# Altium project PCB_Project.PrjPcb (part 1 of 2)
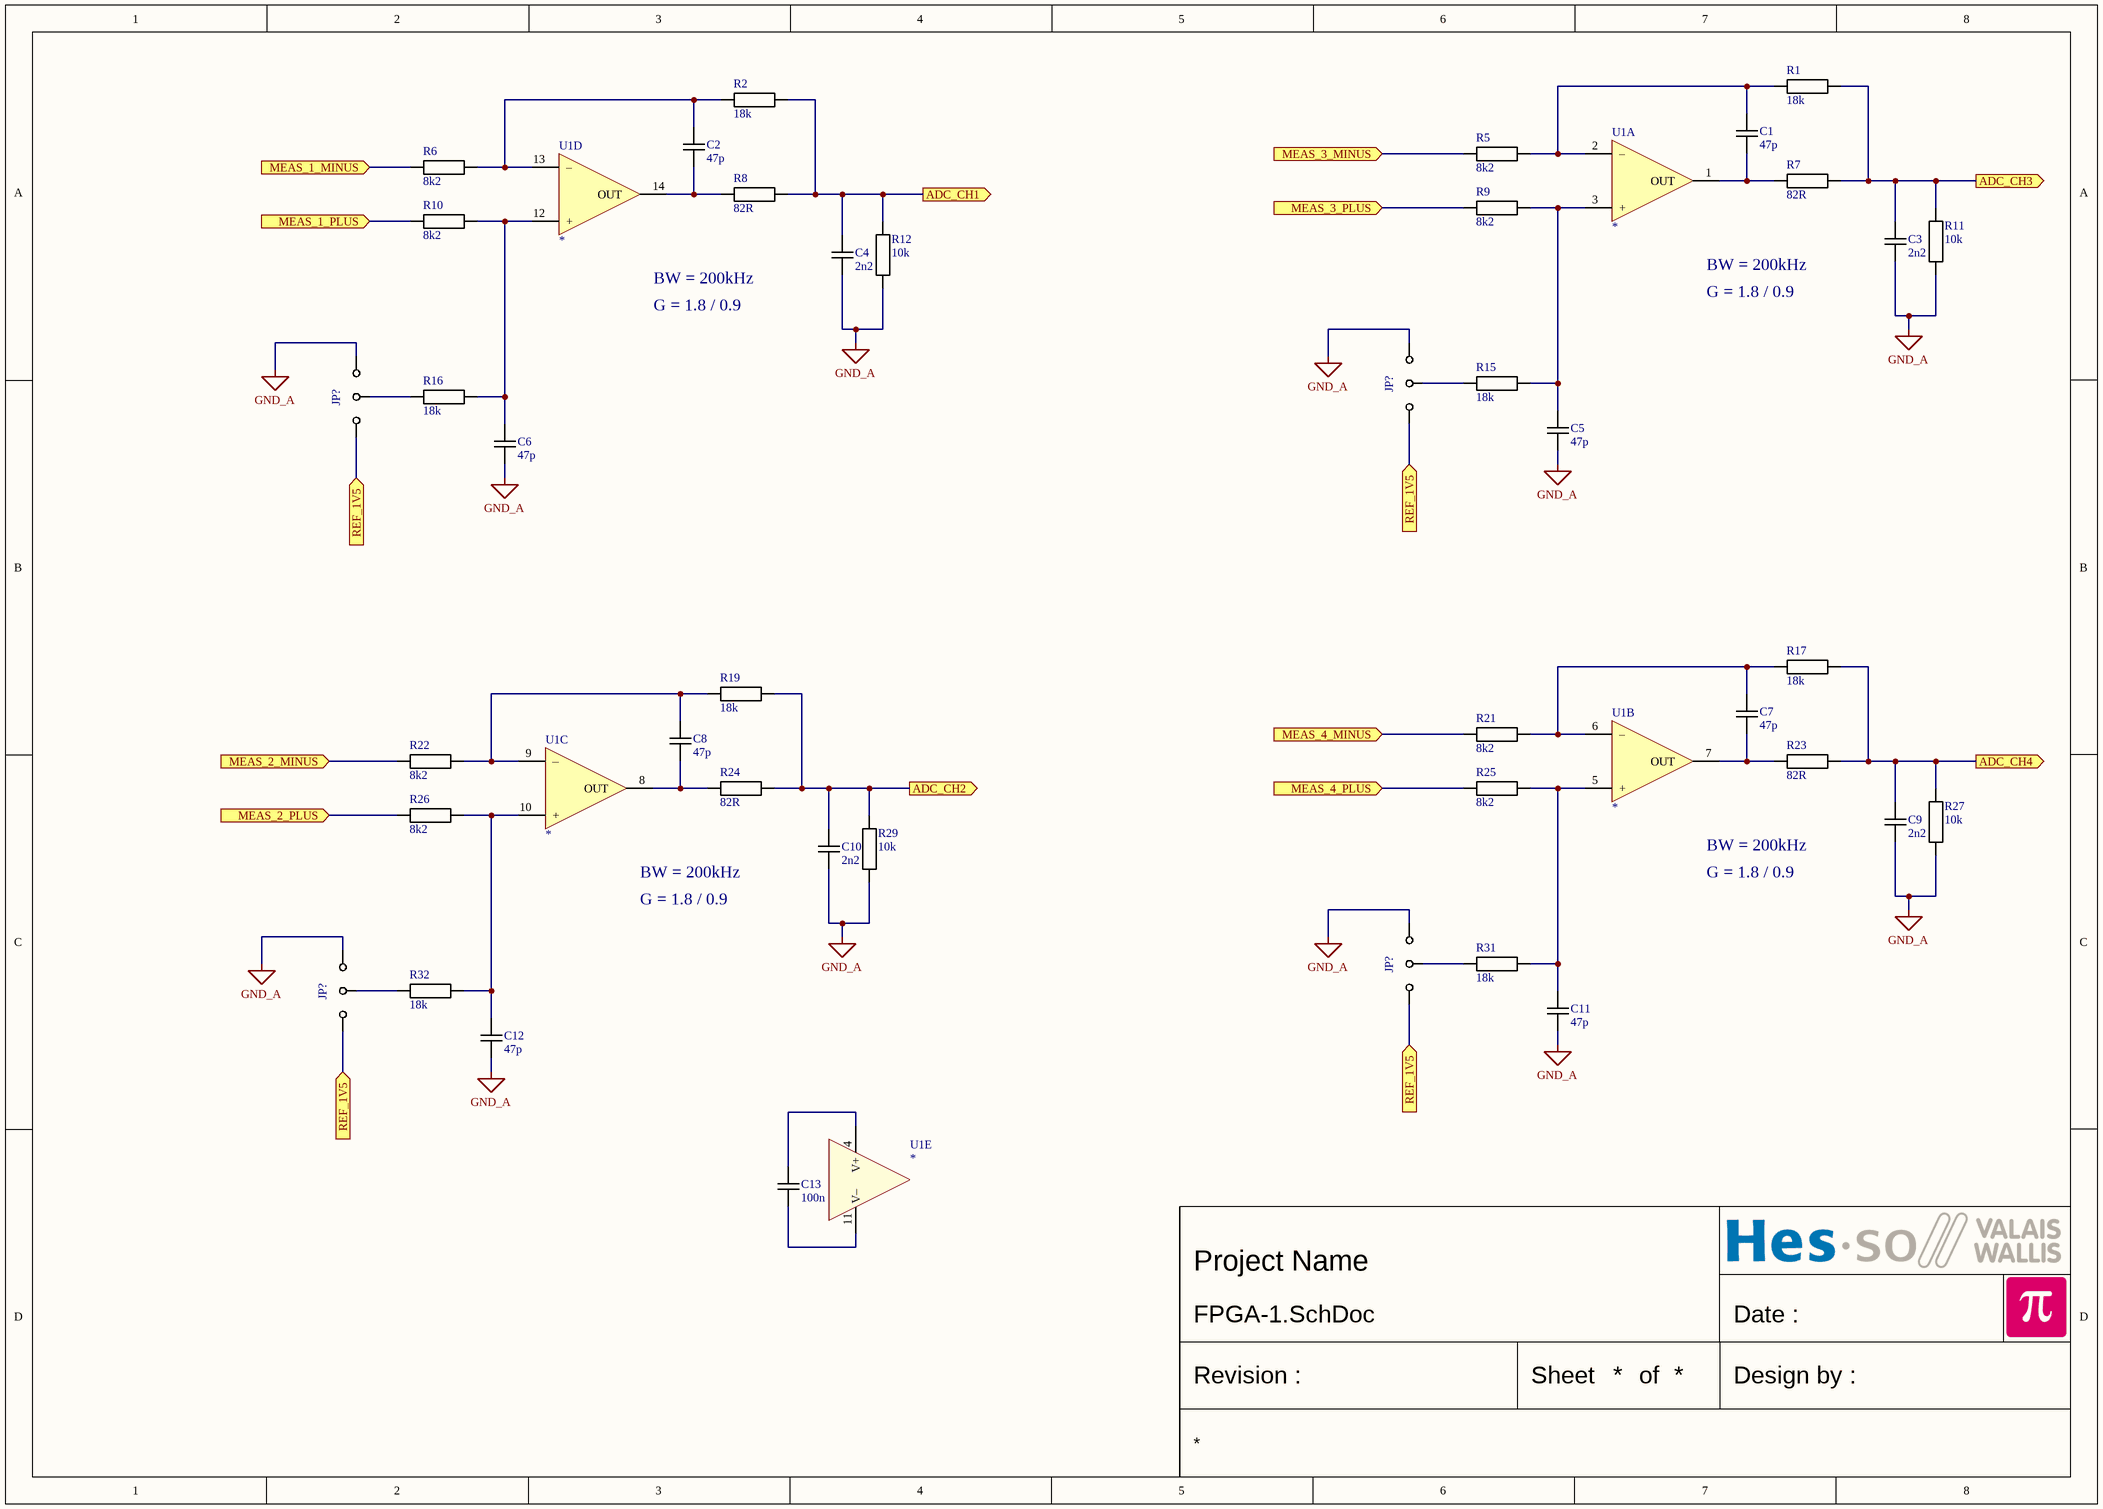
[diagram p0: FPGA-1.SchDoc]
11 sheets, 366 parts. Net scope: flat (ports and power ports of the same name join across sheets).
Board file: PCB-FPGA.PcbDoc
Sheets:
  FPGA-1.SchDoc
  FPGA.SchDoc
  FPGA-8.SchDoc
  FPGA-2.SchDoc
  FPGA-3.SchDoc
  FPGA-4.SchDoc
  FPGA-5.SchDoc
  FPGA-6.SchDoc
  FPGA-7.SchDoc
  FPGA-Connector.SchDoc
  FPGA-Supply.SchDoc

## Sheet FPGA-1.SchDoc
size A3; Date: Date; CompanyName: HESSO; Engineer: Name; Address1: Route du Rawyl 47; Address2: 1950 Sion; Address3: Switzerland; ProjectName: Project Name

### Parts
(Parts that share a designator on the sheet are numbered #1, #2 ... from top to bottom, then left to right.)
C1  47p  [CAPACITOR 1608 REFLOW]
C2  47p  [CAPACITOR 1608 REFLOW]
C3  2n2  [CAPACITOR 1608 REFLOW]
C4  2n2  [CAPACITOR 1608 REFLOW]
C5  47p  [CAPACITOR 1608 REFLOW]
C6  47p  [CAPACITOR 1608 REFLOW]
C7  47p  [CAPACITOR 1608 REFLOW]
C8  47p  [CAPACITOR 1608 REFLOW]
C9  2n2  [CAPACITOR 1608 REFLOW]
C10  2n2  [CAPACITOR 1608 REFLOW]
C11  47p  [CAPACITOR 1608 REFLOW]
C12  47p  [CAPACITOR 1608 REFLOW]
C13  100n  [CAPACITOR 1608 REFLOW]
JP?#1  {Value}  [JUMPER3 SMD 1608]  (value not drawn)
JP?#2  {Value}  [JUMPER3 SMD 1608]  (value not drawn)
JP?#3  {Value}  [JUMPER3 SMD 1608]  (value not drawn)
JP?#4  {Value}  [JUMPER3 SMD 1608]  (value not drawn)
R1  18k  [RESISTOR 1608 REFLOW]
R2  18k  [RESISTOR 1608 REFLOW]
R5  8k2  [RESISTOR 1608 REFLOW]
R6  8k2  [RESISTOR 1608 REFLOW]
R7  82R  [RESISTOR 1608 REFLOW]
R8  82R  [RESISTOR 1608 REFLOW]
R9  8k2  [RESISTOR 1608 REFLOW]
R10  8k2  [RESISTOR 1608 REFLOW]
R11  10k  [RESISTOR 1608 REFLOW]
R12  10k  [RESISTOR 1608 REFLOW]
R15  18k  [RESISTOR 1608 REFLOW]
R16  18k  [RESISTOR 1608 REFLOW]
R17  18k  [RESISTOR 1608 REFLOW]
R19  18k  [RESISTOR 1608 REFLOW]
R21  8k2  [RESISTOR 1608 REFLOW]
R22  8k2  [RESISTOR 1608 REFLOW]
R23  82R  [RESISTOR 1608 REFLOW]
R24  82R  [RESISTOR 1608 REFLOW]
R25  8k2  [RESISTOR 1608 REFLOW]
R26  8k2  [RESISTOR 1608 REFLOW]
R27  10k  [RESISTOR 1608 REFLOW]
R29  10k  [RESISTOR 1608 REFLOW]
R31  18k  [RESISTOR 1608 REFLOW]
R32  18k  [RESISTOR 1608 REFLOW]
U1  *  [SO14 P1.27 C4.0X8.8 H1.75]  (parts A,B,C,D,E of 5)

### Ports
ADC_CH1 (out), ADC_CH2 (out), ADC_CH3 (out), ADC_CH4 (out), MEAS_1_MINUS (in), MEAS_1_PLUS (in), MEAS_2_MINUS (in), MEAS_2_PLUS (in), MEAS_3_MINUS (in), MEAS_3_PLUS (in), MEAS_4_MINUS (in), MEAS_4_PLUS (in), REF_1V5 (in)

### Nets
GND_A: C3.1 C4.1 C5.1 C6.1 C9.1 C10.1 C11.1 C12.1 JP?#1.3 JP?#2.3 JP?#3.3 JP?#4.3 R11.2 R12.2 R27.2 R29.2
NetC1_1: C1.1 R7.1 U1.1(OUT)
NetC1_2: C1.2 R1.1 R5.2 U1.2(–)
NetC2_1: C2.1 R8.1 U1.14(OUT)
NetC2_2: C2.2 R2.1 R6.2 U1.13(–)
NetC3_2: C3.2 R1.2 R7.2 R11.1 ; port ADC_CH3
NetC4_2: C4.2 R2.2 R8.2 R12.1 ; port ADC_CH1
NetC5_2: C5.2 R9.2 R15.1 U1.3(+)
NetC6_2: C6.2 R10.2 R16.1 U1.12(+)
NetC7_1: C7.1 R23.1 U1.7(OUT)
NetC7_2: C7.2 R17.1 R21.2 U1.6(–)
NetC8_1: C8.1 R24.1 U1.8(OUT)
NetC8_2: C8.2 R19.1 R22.2 U1.9(–)
NetC9_2: C9.2 R17.2 R23.2 R27.1 ; port ADC_CH4
NetC10_2: C10.2 R19.2 R24.2 R29.1 ; port ADC_CH2
NetC11_2: C11.2 R25.2 R31.1 U1.5(+)
NetC12_2: C12.2 R26.2 R32.1 U1.10(+)
NetC13_1: C13.1 U1.11(V–)
NetC13_2: C13.2 U1.4(V+)
NetC106_2: JP?#1.1 JP?#2.1 JP?#3.1 JP?#4.1 ; port REF_1V5
NetJ9_3: R6.1 ; port MEAS_1_MINUS
NetJ9_4: R10.1 ; port MEAS_1_PLUS
NetJ9_5: R22.1 ; port MEAS_2_MINUS
NetJ9_6: R26.1 ; port MEAS_2_PLUS
NetJ9_7: R5.1 ; port MEAS_3_MINUS
NetJ9_8: R9.1 ; port MEAS_3_PLUS
NetJ9_9: R21.1 ; port MEAS_4_MINUS
NetJ9_10: R25.1 ; port MEAS_4_PLUS
NetJP?#1_2: JP?#1.2 R15.2
NetJP?#2_2: JP?#2.2 R16.2
NetJP?#3_2: JP?#3.2 R31.2
NetJP?#4_2: JP?#4.2 R32.2

### Notes on the sheet
- BW = 200kHz
- G = 1.8 / 0.9
- Date :
- Revision :
- Sheet
- of
- Design by :

### Library data of the parts
C1-C13 = Capacitor: Capacitor X7R 10% 50V 1608(0603)
  C1 C2 C5-C8 C11 C12: Value: 47p
  C3 C4 C9 C10: Value: 2n2
  C13: Value: 100n
JP?#1-JP?#4 = JUMPER 3 POS: Value: {Value}
R1 R2 R5-R12 R15-R17 R19 R21-R27 R29 R31 R32 = Resistor: Resistor 1% 50V 100mW 1608(0603)
  R1 R2 R15-R17 R19 R31 R32: Value: 18k
  R5 R6 R9 R10 R21 R22 R25 R26: Value: 8k2
  R7 R8 R23 R24: Value: 82R
  R11 R12 R27 R29: Value: 10k
U1 = OPA QUAD: Generic quad OPA 14 pins; Value: *

## Sheet FPGA.SchDoc
size A2; Date: Date; CompanyName: HESSO; Engineer: Name; Address1: Route du Rawyl 47; Address2: 1950 Sion; Address3: Switzerland; ProjectName: Project Name
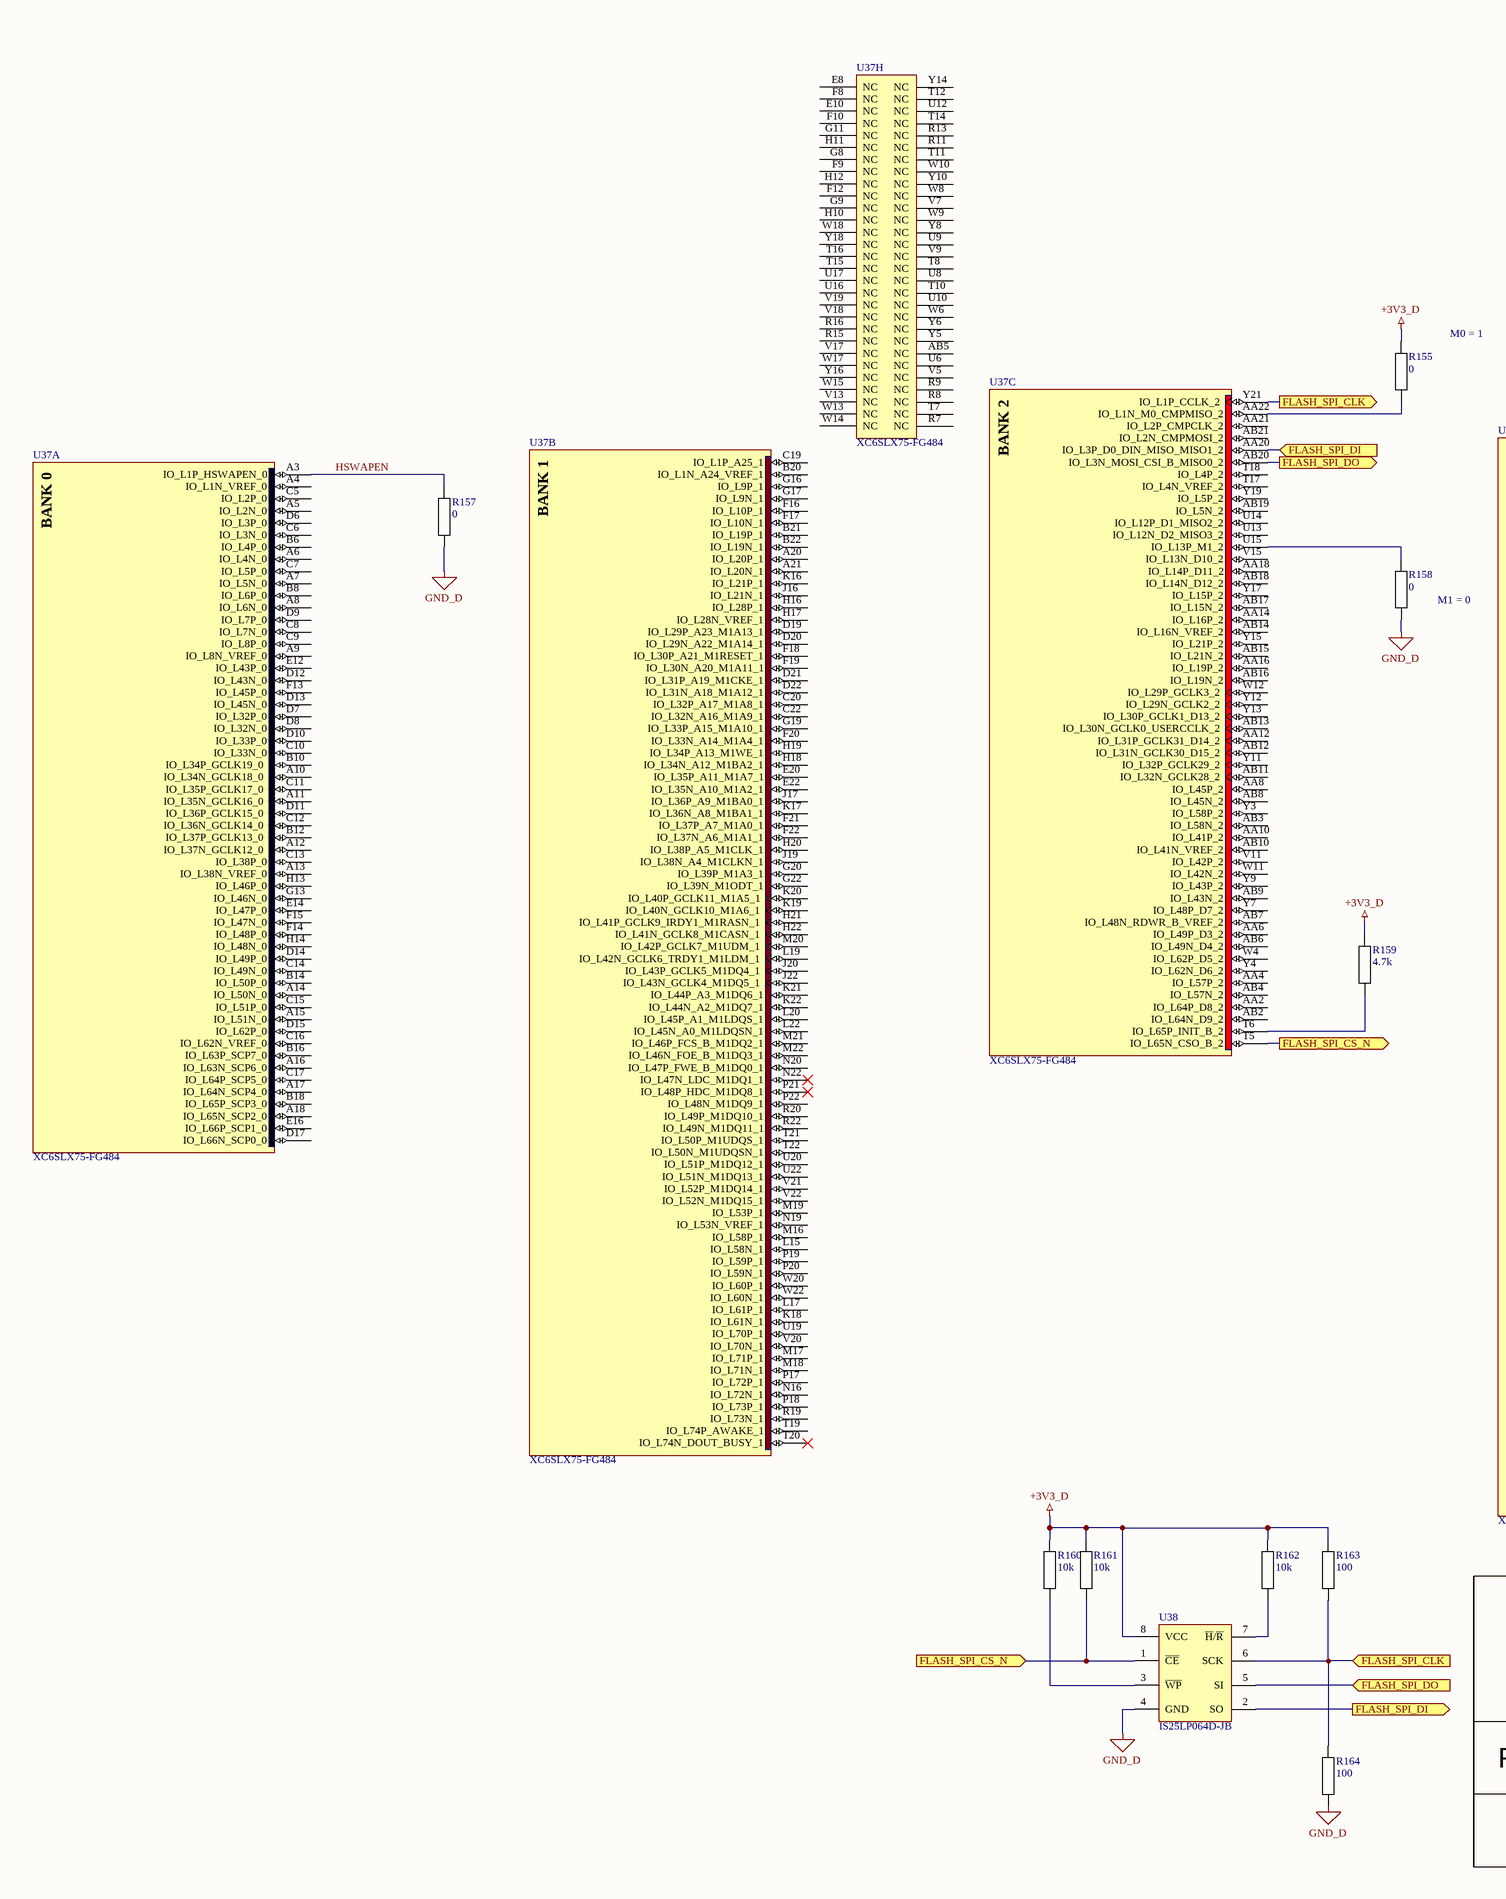
[diagram p1: FPGA.SchDoc, left]
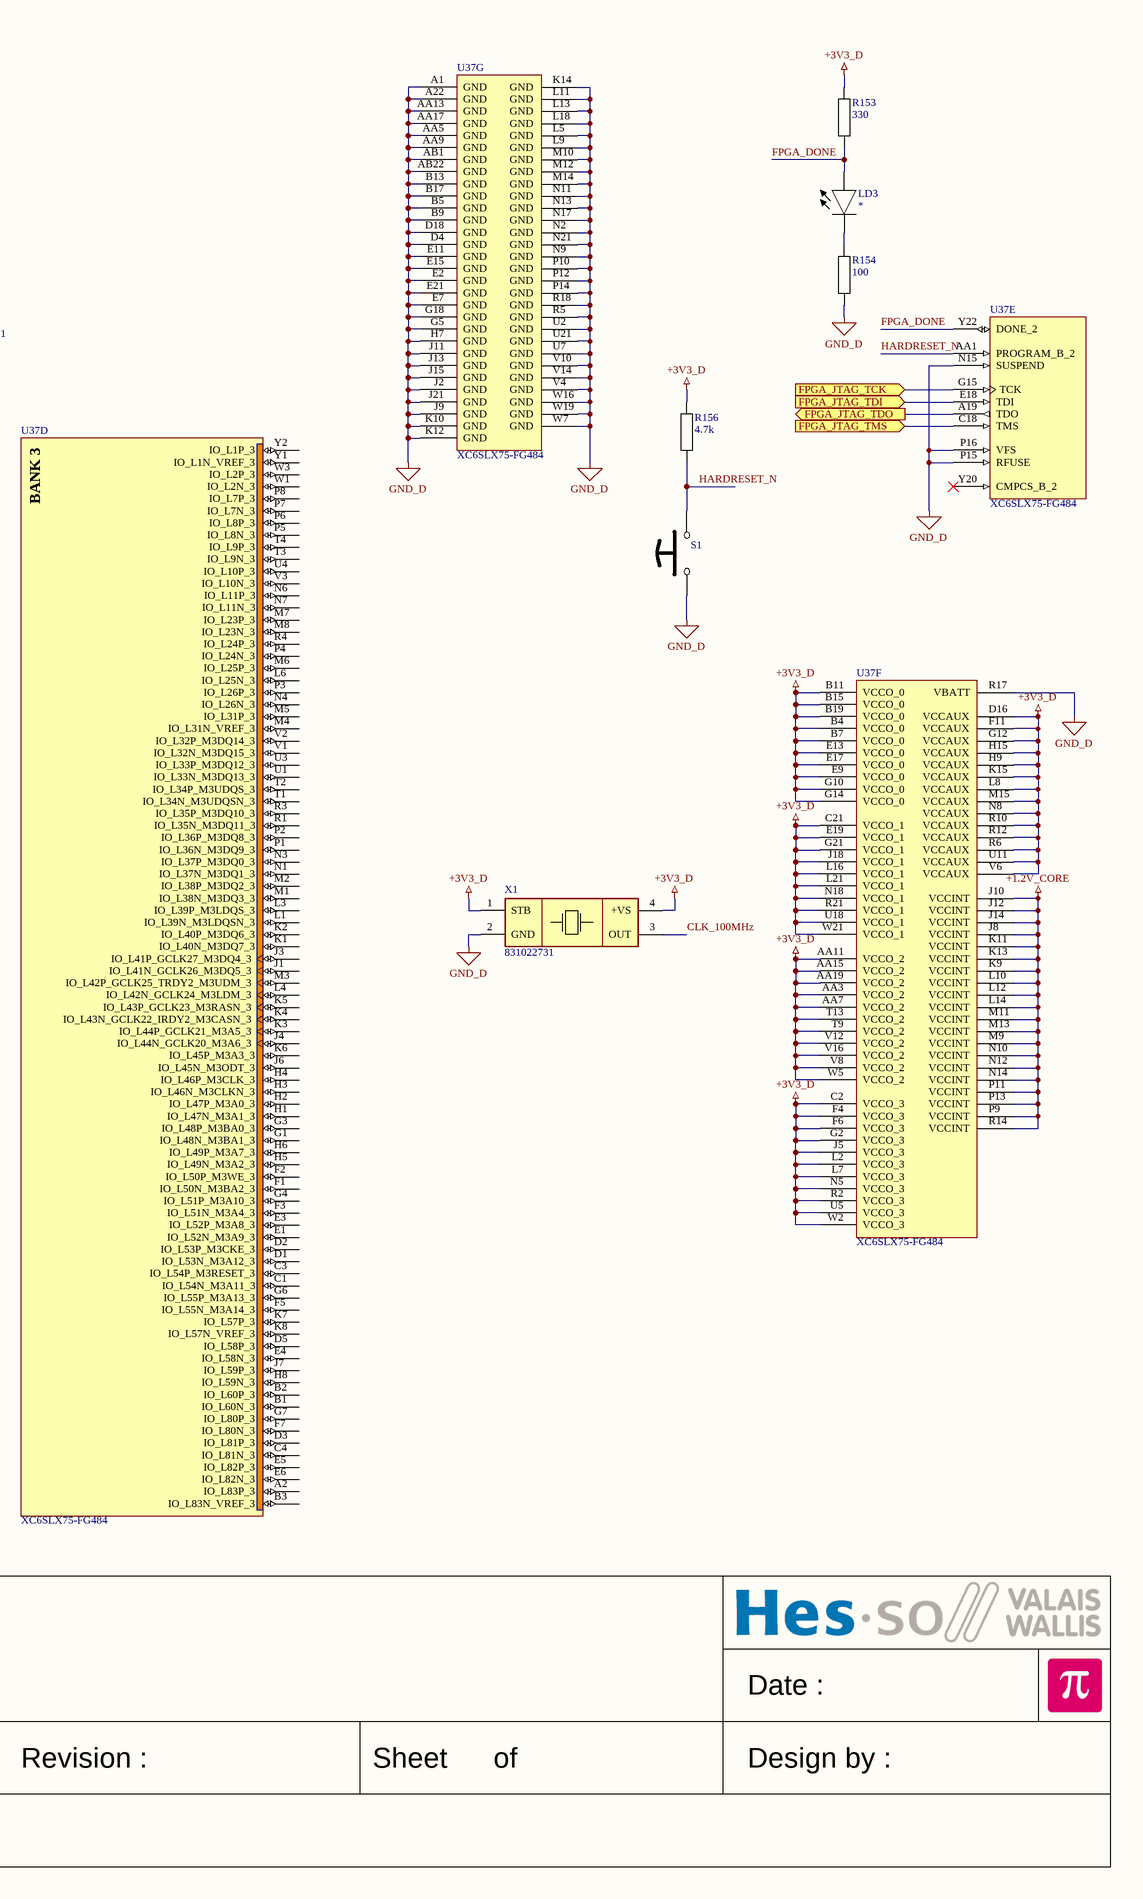
[diagram p2: FPGA.SchDoc, right]

### Parts
LD3  *  [LED 1608 REFLOW]
R153  330  [RESISTOR 2012 REFLOW]
R154  100  [RESISTOR 2012 REFLOW]
R155  0  [RESISTOR 2012 REFLOW]
R156  4.7k  [RESISTOR 2012 REFLOW]
R157  0  [RESISTOR 2012 REFLOW]
R158  0  [RESISTOR 2012 REFLOW]
R159  4.7k  [RESISTOR 2012 REFLOW]
R160  10k  [RESISTOR 1608 REFLOW]
R161  10k  [RESISTOR 1608 REFLOW]
R162  10k  [RESISTOR 1608 REFLOW]
R163  100  [RESISTOR 1608 REFLOW]
R164  100  [RESISTOR 1608 REFLOW]
S1  *  [Push Button C2.5X3.0 OMRON B3U-1000P(M)-B]  (value not drawn)
U37  XC6SLX75-FG484  [BGA484 P1.0 C23X23 H2.2]  (parts A,B,C,D,E,F,G,H of 8)
U38  IS25LP064D-JB  [SO8 P1.27 C4.0X5.0 H1.75]
X1  831022731  [Oscillator C5.2x7.2 IQD LFSPXO]

### Ports
FLASH_SPI_CLK (in), FLASH_SPI_CLK (out), FLASH_SPI_CS_N (in), FLASH_SPI_CS_N (out), FLASH_SPI_DI (in), FLASH_SPI_DI (out), FLASH_SPI_DO (in), FLASH_SPI_DO (out), FPGA_JTAG_TCK (in), FPGA_JTAG_TDI (in), FPGA_JTAG_TDO (out), FPGA_JTAG_TMS (in)

### Nets
+1.2V_CORE: U37.J8(VCCINT) U37.J10(VCCINT) U37.J12(VCCINT) U37.J14(VCCINT) U37.K9(VCCINT) U37.K11(VCCINT) U37.K13(VCCINT) U37.L10(VCCINT) U37.L12(VCCINT) U37.L14(VCCINT) U37.M9(VCCINT) U37.M11(VCCINT) U37.M13(VCCINT) U37.N10(VCCINT) U37.N12(VCCINT) U37.N14(VCCINT) U37.P9(VCCINT) U37.P11(VCCINT) U37.P13(VCCINT) U37.R14(VCCINT)
+3V3_D: R153.2 R155.2 R156.2 R159.2 R160.2 R161.2 R162.2 R163.2 U37.AA3(VCCO_2) U37.AA7(VCCO_2) U37.AA11(VCCO_2) U37.AA15(VCCO_2) U37.AA19(VCCO_2) U37.B4(VCCO_0) U37.B7(VCCO_0) U37.B11(VCCO_0) U37.B15(VCCO_0) U37.B19(VCCO_0) U37.C2(VCCO_3) U37.C21(VCCO_1) U37.D16(VCCAUX) U37.E9(VCCO_0) U37.E13(VCCO_0) U37.E17(VCCO_0) U37.E19(VCCO_1) U37.F4(VCCO_3) U37.F6(VCCO_3) U37.F11(VCCAUX) U37.G2(VCCO_3) U37.G10(VCCO_0) U37.G12(VCCAUX) U37.G14(VCCO_0) U37.G21(VCCO_1) U37.H9(VCCAUX) U37.H15(VCCAUX) U37.J5(VCCO_3) U37.J18(VCCO_1) U37.K15(VCCAUX) U37.L2(VCCO_3) U37.L7(VCCO_3) U37.L8(VCCAUX) U37.L16(VCCO_1) U37.L21(VCCO_1) U37.M15(VCCAUX) U37.N5(VCCO_3) U37.N8(VCCAUX) U37.N18(VCCO_1) U37.R2(VCCO_3) U37.R6(VCCAUX) U37.R10(VCCAUX) U37.R12(VCCAUX) U37.R21(VCCO_1) U37.T9(VCCO_2) U37.T13(VCCO_2) U37.U5(VCCO_3) U37.U11(VCCAUX) U37.U18(VCCO_1) U37.V6(VCCAUX) U37.V8(VCCO_2) U37.V12(VCCO_2) U37.V16(VCCO_2) U37.W2(VCCO_3) U37.W5(VCCO_2) U37.W21(VCCO_1) U38.8(VCC) X1.1(STB) X1.4(+VS)
GND_D: R154.1 R157.1 R158.1 R164.1 S1.1 U37.A1(GND) U37.A22(GND) U37.AA5(GND) U37.AA9(GND) U37.AA13(GND) U37.AA17(GND) U37.AB1(GND) U37.AB22(GND) U37.B5(GND) U37.B9(GND) U37.B13(GND) U37.B17(GND) U37.D4(GND) U37.D18(GND) U37.E2(GND) U37.E7(GND) U37.E11(GND) U37.E15(GND) U37.E21(GND) U37.G5(GND) U37.G18(GND) U37.H7(GND) U37.J2(GND) U37.J9(GND) U37.J11(GND) U37.J13(GND) U37.J15(GND) U37.J21(GND) U37.K10(GND) U37.K12(GND) U37.K14(GND) U37.L5(GND) U37.L9(GND) U37.L11(GND) U37.L13(GND) U37.L18(GND) U37.M10(GND) U37.M12(GND) U37.M14(GND) U37.N2(GND) U37.N9(GND) U37.N11(GND) U37.N13(GND) U37.N15(SUSPEND) U37.N17(GND) U37.N21(GND) U37.P10(GND) U37.P12(GND) U37.P14(GND) U37.P15(RFUSE) U37.P16(VFS) U37.R5(GND) U37.R17(VBATT) U37.R18(GND) U37.U2(GND) U37.U7(GND) U37.U21(GND) U37.V4(GND) U37.V10(GND) U37.V14(GND) U37.W7(GND) U37.W16(GND) U37.W19(GND) U38.4(GND) X1.2(GND)
CLK_100MHz: X1.3(OUT)
FPGA_DONE: LD3.2(A) R153.1 U37.Y22(DONE_2)
HARDRESET_N: R156.1 S1.2 U37.AA1(PROGRAM_B_2)
HSWAPEN: R157.2 U37.A3(IO_L1P_HSWAPEN_0)
NetJ12_3: U37.C18(TMS) ; port FPGA_JTAG_TMS
NetJ12_5: U37.G15(TCK) ; port FPGA_JTAG_TCK
NetJ12_7: U37.A19(TDO) ; port FPGA_JTAG_TDO
NetJ12_9: U37.E18(TDI) ; port FPGA_JTAG_TDI
NetLD3_1: LD3.1(C) R154.2
NetR155_1: R155.1 U37.AA22(IO_L1N_M0_CMPMISO_2)
NetR158_2: R158.2 U37.U15(IO_L13P_M1_2)
NetR159_1: R159.1 U37.T6(IO_L65P_INIT_B_2)
NetR160_1: R160.1 U38.3(~{WP})
NetR161_1: R161.1 U37.T5(IO_L65N_CSO_B_2) U38.1(~{CE}) ; port FLASH_SPI_CS_N
NetR162_1: R162.1 U38.7(~{H}/~{R})
NetR163_1: R163.1 R164.2 U37.Y21(IO_L1P_CCLK_2) U38.6(SCK) ; port FLASH_SPI_CLK
NetU37_AA20: U37.AA20(IO_L3P_D0_DIN_MISO_MISO1_2) U38.2(SO) ; port FLASH_SPI_DI
NetU37_AB20: U37.AB20(IO_L3N_MOSI_CSI_B_MISO0_2) U38.5(SI) ; port FLASH_SPI_DO

Not connected (* = marked no-connect by the designer): U37 A2(IO_L83P_3) A4(IO_L1N_VREF_0) A5(IO_L2N_0) A6(IO_L4N_0) A7(IO_L5N_0) A8(IO_L6N_0) A9(IO_L8N_VREF_0) A10(IO_L34N_GCLK18_0) A11(IO_L35N_GCLK16_0) A12(IO_L37N_GCLK12_0) A13(IO_L38N_VREF_0) A14(IO_L50N_0) A15(IO_L51N_0) A16(IO_L63N_SCP6_0) A17(IO_L64N_SCP4_0) A18(IO_L65N_SCP2_0) A20(IO_L20P_1) A21(IO_L20N_1) AA2(IO_L64P_D8_2) AA4(IO_L57P_2) AA6(IO_L49P_D3_2) AA8(IO_L45P_2) AA10(IO_L41P_2) AA12(IO_L31P_GCLK31_D14_2) AA14(IO_L16P_2) AA16(IO_L19P_2) AA18(IO_L14P_D11_2) AA21(IO_L2P_CMPCLK_2) AB2(IO_L64N_D9_2) AB3(IO_L58N_2) AB4(IO_L57N_2) AB5(NC) AB6(IO_L49N_D4_2) AB7(IO_L48N_RDWR_B_VREF_2) AB8(IO_L45N_2) AB9(IO_L43N_2) AB10(IO_L41N_VREF_2) AB11(IO_L32N_GCLK28_2) AB12(IO_L31N_GCLK30_D15_2) AB13(IO_L30N_GCLK0_USERCCLK_2) AB14(IO_L16N_VREF_2) AB15(IO_L21N_2) AB16(IO_L19N_2) AB17(IO_L15N_2) AB18(IO_L14N_D12_2) AB19(IO_L5N_2) AB21(IO_L2N_CMPMOSI_2) B1(IO_L60N_3) B2(IO_L60P_3) B3(IO_L83N_VREF_3) B6(IO_L4P_0) B8(IO_L6P_0) B10(IO_L34P_GCLK19_0) B12(IO_L37P_GCLK13_0) B14(IO_L50P_0) B16(IO_L63P_SCP7_0) B18(IO_L65P_SCP3_0) B20(IO_L1N_A24_VREF_1) B21(IO_L19P_1) B22(IO_L19N_1) C1(IO_L54N_M3A11_3) C3(IO_L54P_M3RESET_3) C4(IO_L81N_3) C5(IO_L2P_0) C6(IO_L3N_0) C7(IO_L5P_0) C8(IO_L7N_0) C9(IO_L8P_0) C10(IO_L33N_0) C11(IO_L35P_GCLK17_0) C12(IO_L36N_GCLK14_0) C13(IO_L38P_0) C14(IO_L49N_0) C15(IO_L51P_0) C16(IO_L62N_VREF_0) C17(IO_L64P_SCP5_0) C19(IO_L1P_A25_1) C20(IO_L32P_A17_M1A8_1) C22(IO_L32N_A16_M1A9_1) D1(IO_L53N_M3A12_3) D2(IO_L53P_M3CKE_3) D3(IO_L81P_3) D5(IO_L58P_3) D6(IO_L3P_0) D7(IO_L32P_0) D8(IO_L32N_0) D9(IO_L7P_0) D10(IO_L33P_0) D11(IO_L36P_GCLK15_0) D12(IO_L43N_0) D13(IO_L45N_0) D14(IO_L49P_0) D15(IO_L62P_0) D17(IO_L66N_SCP0_0) D19(IO_L29P_A23_M1A13_1) D20(IO_L29N_A22_M1A14_1) D21(IO_L31P_A19_M1CKE_1) D22(IO_L31N_A18_M1A12_1) E1(IO_L52N_M3A9_3) E3(IO_L52P_M3A8_3) E4(IO_L58N_3) E5(IO_L82P_3) E6(IO_L82N_3) E8(NC) E10(NC) E12(IO_L43P_0) E14(IO_L47P_0) E16(IO_L66P_SCP1_0) E20(IO_L35P_A11_M1A7_1) E22(IO_L35N_A10_M1A2_1) F1(IO_L50N_M3BA2_3) F2(IO_L50P_M3WE_3) F3(IO_L51N_M3A4_3) F5(IO_L55N_M3A14_3) F7(IO_L80N_3) F8(NC) F9(NC) F10(NC) F12(NC) F13(IO_L45P_0) F14(IO_L48P_0) F15(IO_L47N_0) F16(IO_L10P_1) F17(IO_L10N_1) F18(IO_L30P_A21_M1RESET_1) F19(IO_L30N_A20_M1A11_1) F20(IO_L33N_A14_M1A4_1) F21(IO_L37P_A7_M1A0_1) F22(IO_L37N_A6_M1A1_1) G1(IO_L48N_M3BA1_3) G3(IO_L48P_M3BA0_3) G4(IO_L51P_M3A10_3) G6(IO_L55P_M3A13_3) G7(IO_L80P_3) G8(NC) G9(NC) G11(NC) G13(IO_L46N_0) G16(IO_L9P_1) G17(IO_L9N_1) G19(IO_L33P_A15_M1A10_1) G20(IO_L39P_M1A3_1) G22(IO_L39N_M1ODT_1) H1(IO_L47N_M3A1_3) H2(IO_L47P_M3A0_3) H3(IO_L46N_M3CLKN_3) H4(IO_L46P_M3CLK_3) H5(IO_L49N_M3A2_3) H6(IO_L49P_M3A7_3) H8(IO_L59N_3) H10(NC) H11(NC) H12(NC) H13(IO_L46P_0) H14(IO_L48N_0) H16(IO_L28P_1) H17(IO_L28N_VREF_1) H18(IO_L34N_A12_M1BA2_1) H19(IO_L34P_A13_M1WE_1) H20(IO_L38P_A5_M1CLK_1) H21(IO_L41P_GCLK9_IRDY1_M1RASN_1) H22(IO_L41N_GCLK8_M1CASN_1) J1(IO_L41N_GCLK26_M3DQ5_3) J3(IO_L41P_GCLK27_M3DQ4_3) J4(IO_L44N_GCLK20_M3A6_3) J6(IO_L45N_M3ODT_3) J7(IO_L59P_3) J16(IO_L21N_1) J17(IO_L36P_A9_M1BA0_1) J19(IO_L38N_A4_M1CLKN_1) J20(IO_L43P_GCLK5_M1DQ4_1) J22(IO_L43N_GCLK4_M1DQ5_1) K1(IO_L40N_M3DQ7_3) K2(IO_L40P_M3DQ6_3) K3(IO_L44P_GCLK21_M3A5_3) K4(IO_L43N_GCLK22_IRDY2_M3CASN_3) K5(IO_L43P_GCLK23_M3RASN_3) K6(IO_L45P_M3A3_3) K7(IO_L57P_3) K8(IO_L57N_VREF_3) K16(IO_L21P_1) K17(IO_L36N_A8_M1BA1_1) K18(IO_L61N_1) K19(IO_L40N_GCLK10_M1A6_1) K20(IO_L40P_GCLK11_M1A5_1) K21(IO_L44P_A3_M1DQ6_1) K22(IO_L44N_A2_M1DQ7_1) L1(IO_L39N_M3LDQSN_3) L3(IO_L39P_M3LDQS_3) L4(IO_L42N_GCLK24_M3LDM_3) L6(IO_L25N_3) L15(IO_L58N_1) L17(IO_L61P_1) L19(IO_L42N_GCLK6_TRDY1_M1LDM_1) L20(IO_L45P_A1_M1LDQS_1) L22(IO_L45N_A0_M1LDQSN_1) M1(IO_L38N_M3DQ3_3) M2(IO_L38P_M3DQ2_3) M3(IO_L42P_GCLK25_TRDY2_M3UDM_3) M4(IO_L31N_VREF_3) M5(IO_L31P_3) M6(IO_L25P_3) M7(IO_L23P_3) M8(IO_L23N_3) M16(IO_L58P_1) M17(IO_L71P_1) M18(IO_L71N_1) M19(IO_L53P_1) M20(IO_L42P_GCLK7_M1UDM_1) M21(IO_L46P_FCS_B_M1DQ2_1) M22(IO_L46N_FOE_B_M1DQ3_1) N1(IO_L37N_M3DQ1_3) N3(IO_L37P_M3DQ0_3) N4(IO_L26N_3) N6(IO_L11P_3) N7(IO_L11N_3) N16(IO_L72N_1) N19(IO_L53N_VREF_1) N20(IO_L47P_FWE_B_M1DQ0_1) N22(IO_L47N_LDC_M1DQ1_1)* P1(IO_L36N_M3DQ9_3) P2(IO_L36P_M3DQ8_3) P3(IO_L26P_3) P4(IO_L24N_3) P5(IO_L8N_3) P6(IO_L8P_3) P7(IO_L7N_3) P8(IO_L7P_3) P17(IO_L72P_1) P18(IO_L73P_1) P19(IO_L59P_1) P20(IO_L59N_1) P21(IO_L48P_HDC_M1DQ8_1)* P22(IO_L48N_M1DQ9_1) R1(IO_L35N_M3DQ11_3) R3(IO_L35P_M3DQ10_3) R4(IO_L24P_3) R7(NC) R8(NC) R9(NC) R11(NC) R13(NC) R15(NC) R16(NC) R19(IO_L73N_1) R20(IO_L49P_M1DQ10_1) R22(IO_L49N_M1DQ11_1) T1(IO_L34N_M3UDQSN_3) T2(IO_L34P_M3UDQS_3) T3(IO_L9N_3) T4(IO_L9P_3) T7(NC) T8(NC) T10(NC) T11(NC) T12(NC) T14(NC) T15(NC) T16(NC) T17(IO_L4N_VREF_2) T18(IO_L4P_2) T19(IO_L74P_AWAKE_1) T20(IO_L74N_DOUT_BUSY_1)* T21(IO_L50P_M1UDQS_1) T22(IO_L50N_M1UDQSN_1) U1(IO_L33N_M3DQ13_3) U3(IO_L33P_M3DQ12_3) U4(IO_L10P_3) U6(NC) U8(NC) U9(NC) U10(NC) U12(NC) U13(IO_L12N_D2_MISO3_2) U14(IO_L12P_D1_MISO2_2) U16(NC) U17(NC) U19(IO_L70P_1) U20(IO_L51P_M1DQ12_1) U22(IO_L51N_M1DQ13_1) V1(IO_L32N_M3DQ15_3) V2(IO_L32P_M3DQ14_3) V3(IO_L10N_3) V5(NC) V7(NC) V9(NC) V11(IO_L42P_2) V13(NC) V15(IO_L13N_D10_2) V17(NC) V18(NC) V19(NC) V20(IO_L70N_1) V21(IO_L52P_M1DQ14_1) V22(IO_L52N_M1DQ15_1) W1(IO_L2N_3) W3(IO_L2P_3) W4(IO_L62P_D5_2) W6(NC) W8(NC) W9(NC) W10(NC) W11(IO_L42N_2) W12(IO_L29P_GCLK3_2) W13(NC) W14(NC) W15(NC) W17(NC) W18(NC) W20(IO_L60P_1) W22(IO_L60N_1) Y1(IO_L1N_VREF_3) Y2(IO_L1P_3) Y3(IO_L58P_2) Y4(IO_L62N_D6_2) Y5(NC) Y6(NC) Y7(IO_L48P_D7_2) Y8(NC) Y9(IO_L43P_2) Y10(NC) Y11(IO_L32P_GCLK29_2) Y12(IO_L29N_GCLK2_2) Y13(IO_L30P_GCLK1_D13_2) Y14(NC) Y15(IO_L21P_2) Y16(NC) Y17(IO_L15P_2) Y18(NC) Y19(IO_L5P_2) Y20(CMPCS_B_2)*

### Notes on the sheet
- M0 = 1
- (near R158) M1 = 0
- Date :
- Revision :
- Sheet
- of
- Design by :
- (in symbol XC6SLX75-FG484, part A) BANK 0
- (in symbol XC6SLX75-FG484, part B) BANK 1
- (in symbol XC6SLX75-FG484, part C) BANK 2
- (in symbol XC6SLX75-FG484, part D) BANK 3

### Library data of the parts
LD3 = LED: LED generic; Value: *
R153-R159 = Resistor: Resistor 1% 50V 125mW 2012(0805)
  R153: Value: 330
  R154: Value: 100
  R155 R157 R158: Value: 0
  R156 R159: Value: 4.7k
R160-R164 = Resistor: Resistor 1% 50V 100mW 1608(0603)
  R160-R162: Value: 10k
  R163 R164: Value: 100
S1 = Push Button 2Pins: Push Button, 2 pins; Value: *
U37 = XC6SLX75-FG484: Spartan-6 LXT 1.2V FPGA, 268 User I/Os, 484-Ball Fine-Pitch BGA (1.0mm Pitch); Value: XC6SLX75-FG484
U38 = IS25LP064D-JB: 64Mb Serial Flash Memory; Value: IS25LP064D-JB
X1 = Oscillator C5.2x7.2 IQD LFSPXO: Value: 831022731; MouserNumber: 710-831022731

## Sheet FPGA-8.SchDoc
size A3; Date: Date; CompanyName: HESSO; Engineer: Name; Address1: Route du Rawyl 47; Address2: 1950 Sion; Address3: Switzerland; ProjectName: Project Name
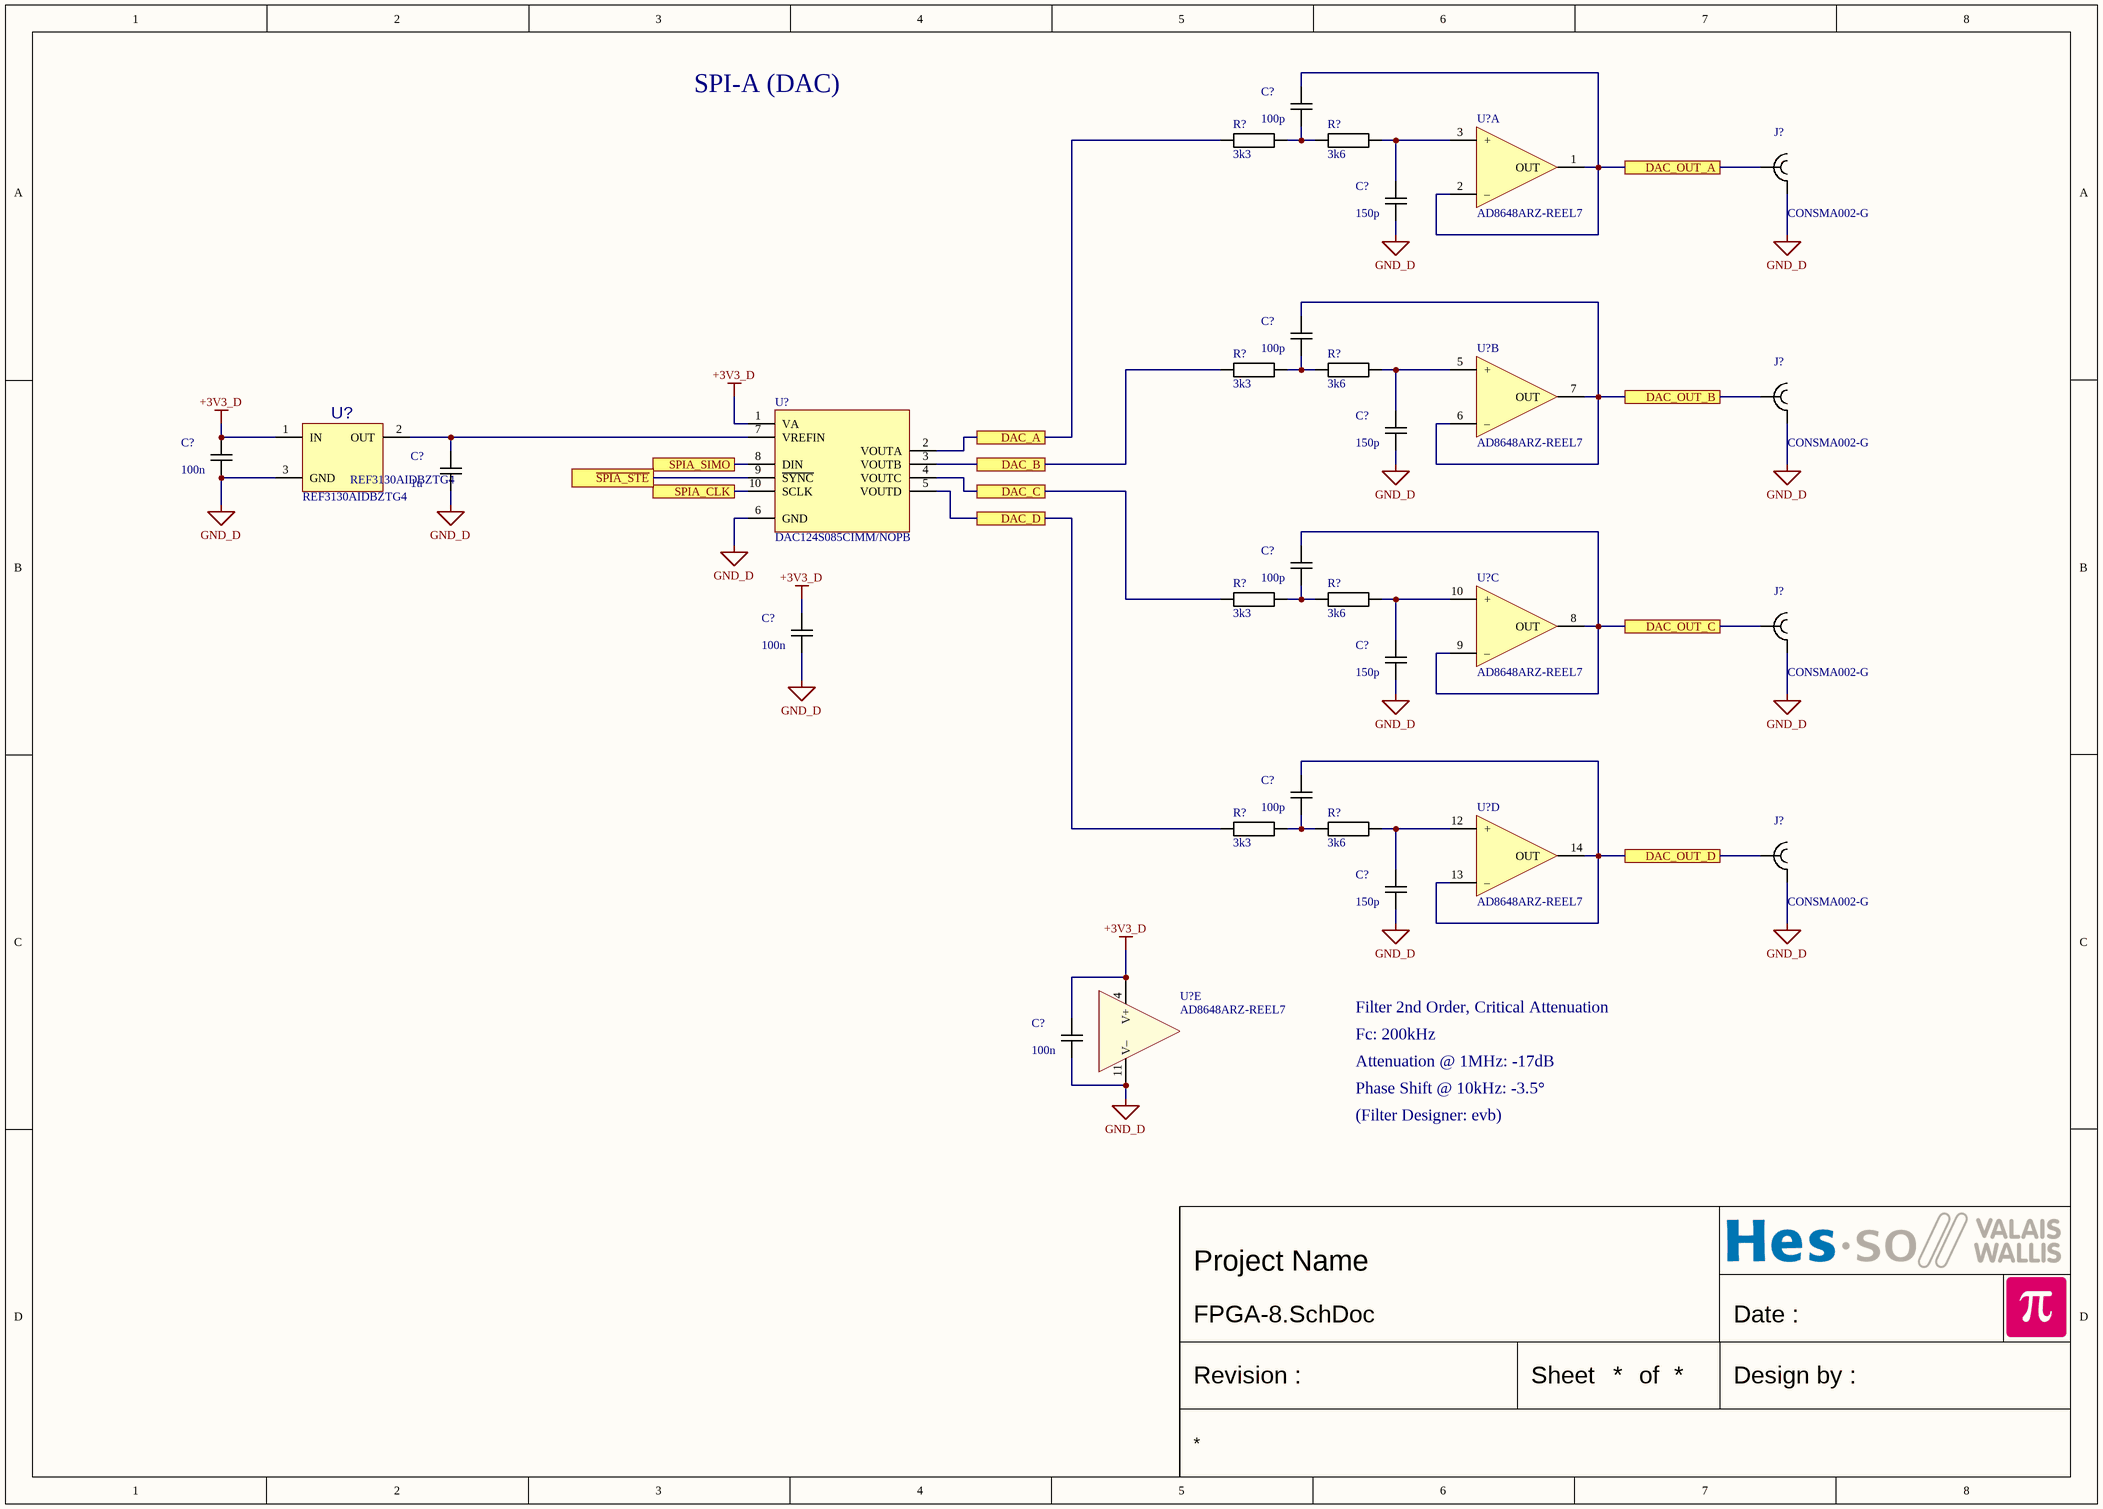
[diagram p3: FPGA-8.SchDoc]

### Parts
(Parts that share a designator on the sheet are numbered #1, #2 ... from top to bottom, then left to right.)
C?#1  100p  [CAPACITOR 2012 REFLOW]
C?#2  150p  [CAPACITOR 2012 REFLOW]
C?#3  100p  [CAPACITOR 2012 REFLOW]
C?#4  150p  [CAPACITOR 2012 REFLOW]
C?#5  100n  [CAPACITOR 2012 REFLOW]
C?#6  1u  [CAPACITOR 2012 REFLOW]
C?#7  100p  [CAPACITOR 2012 REFLOW]
C?#8  100n  [CAPACITOR 1608 REFLOW]
C?#9  150p  [CAPACITOR 2012 REFLOW]
C?#10  100p  [CAPACITOR 2012 REFLOW]
C?#11  150p  [CAPACITOR 2012 REFLOW]
C?#12  100n  [CAPACITOR 1608 REFLOW]
J?#1  CONSMA002-G  [SMA TH Right Angle Linx CONSMA002]
J?#2  CONSMA002-G  [SMA TH Right Angle Linx CONSMA002]
J?#3  CONSMA002-G  [SMA TH Right Angle Linx CONSMA002]
J?#4  CONSMA002-G  [SMA TH Right Angle Linx CONSMA002]
R?#1  3k3  [RESISTOR 2012 REFLOW]
R?#2  3k6  [RESISTOR 2012 REFLOW]
R?#3  3k3  [RESISTOR 2012 REFLOW]
R?#4  3k6  [RESISTOR 2012 REFLOW]
R?#5  3k3  [RESISTOR 2012 REFLOW]
R?#6  3k6  [RESISTOR 2012 REFLOW]
R?#7  3k3  [RESISTOR 2012 REFLOW]
R?#8  3k6  [RESISTOR 2012 REFLOW]
U?#1  AD8648ARZ-REEL7  [SO14 P1.27 C4.0X8.8 H1.75]  (part A of 5)
U?#2  DAC124S085CIMM/NOPB  [VSSOP10 P0.5 C3.1X3.1 H1.1]
U?#3  AD8648ARZ-REEL7  [SO14 P1.27 C4.0X8.8 H1.75]  (part B of 5)
U?#4  REF3130AIDBZTG4  [SOT23 P0.95 C1.6x3.0 H1.3]
U?#5  AD8648ARZ-REEL7  [SO14 P1.27 C4.0X8.8 H1.75]  (part C of 5)
U?#6  AD8648ARZ-REEL7  [SO14 P1.27 C4.0X8.8 H1.75]  (part D of 5)
U?#7  AD8648ARZ-REEL7  [SO14 P1.27 C4.0X8.8 H1.75]  (part E of 5)

### Ports
DAC_A, DAC_B, DAC_C, DAC_D, DAC_OUT_A, DAC_OUT_B, DAC_OUT_C, DAC_OUT_D, SPIA_CLK, SPIA_SIMO, ~{SPIA_STE}

### Nets
+3V3_D: C?#5.2 C?#8.2 C?#12.2 U?#2.1(VA) U?#4.1(IN) U?#7.4(V+)
GND_D: C?#2.1 C?#4.1 C?#5.1 C?#6.1 C?#8.1 C?#9.1 C?#11.1 C?#12.1 J?#1.2 J?#2.2 J?#3.2 J?#4.2 U?#2.6(GND) U?#4.3(GND) U?#7.11(V–)
NetC?#1_1: C?#1.1 R?#1.2 R?#2.1
NetC?#1_2: C?#1.2 J?#1.1 U?#1.1(OUT) U?#1.2(–) ; port DAC_OUT_A
NetC?#2_2: C?#2.2 R?#2.2 U?#1.3(+)
NetC?#3_1: C?#3.1 R?#3.2 R?#4.1
NetC?#3_2: C?#3.2 J?#2.1 U?#3.6(–) U?#3.7(OUT) ; port DAC_OUT_B
NetC?#4_2: C?#4.2 R?#4.2 U?#3.5(+)
NetC?#6_2: C?#6.2 U?#2.7(VREFIN) U?#4.2(OUT)
NetC?#7_1: C?#7.1 R?#5.2 R?#6.1
NetC?#7_2: C?#7.2 J?#3.1 U?#5.8(OUT) U?#5.9(–) ; port DAC_OUT_C
NetC?#9_2: C?#9.2 R?#6.2 U?#5.10(+)
NetC?#10_1: C?#10.1 R?#7.2 R?#8.1
NetC?#10_2: C?#10.2 J?#4.1 U?#6.13(–) U?#6.14(OUT) ; port DAC_OUT_D
NetC?#11_2: C?#11.2 R?#8.2 U?#6.12(+)
NetR?#1_1: R?#1.1 U?#2.2(VOUTA) ; port DAC_A
NetR?#3_1: R?#3.1 U?#2.3(VOUTB) ; port DAC_B
NetR?#5_1: R?#5.1 U?#2.4(VOUTC) ; port DAC_C
NetR?#7_1: R?#7.1 U?#2.5(VOUTD) ; port DAC_D
NetU?#2_8: U?#2.8(DIN) ; port SPIA_SIMO
NetU?#2_9: U?#2.9(~{SYNC}) ; port ~{SPIA_STE}
NetU?#2_10: U?#2.10(SCLK) ; port SPIA_CLK

### Notes on the sheet
- SPI-A (DAC)
- Filter 2nd Order, Critical Attenuation
- Fc: 200kHz
- Attenuation @ 1MHz: -17dB
- Phase Shift @ 10kHz: -3.5°
- (Filter Designer: evb)
- Date :
- Revision :
- Sheet
- of
- Design by :

### Library data of the parts
C?#1-C?#5 C?#7 C?#9-C?#11 = Capacitor: Capacitor X7R 10% 50V 2012(0805)
  C?#1 C?#3 C?#7 C?#10: Value: 100p
  C?#2 C?#4 C?#9 C?#11: Value: 150p
  C?#5: Value: 100n
C?#6 = Capacitor: Capacitor X7R 10% 10V 2012(0805); Value: 1u
C?#8 C?#12 = Capacitor: Capacitor X7R 10% 50V 1608(0603); Value: 100n
J?#1-J?#4 = SMA TH RIGHT ANGLE LINX CONSMA002: Manufacturer: Linx Technologies; Value: CONSMA002-G; Mouser No.: 712-CONSMA002-G
R?#1-R?#8 = Resistor: Resistor 1% 50V 125mW 2012(0805)
  R?#1 R?#3 R?#5 R?#7: Value: 3k3
  R?#2 R?#4 R?#6 R?#8: Value: 3k6
U?#1 U?#3 U?#5-U?#7 = OPA QUAD: Generic quad OPA 14 pins; Manufacturer: Analog Devices; Value: AD8648ARZ-REEL7; Mouser No.: 584-AD8648ARZ-R7
U?#2 = DAC124S085CIMM: DAC124S085 12-Bit Micro Power Quad Digital-to-Analog Converter With Rail-to-Rail Output; Manufacturer: Texas Instruments; Value: DAC124S085CIMM/NOPB; Mouser No.: 926-DAC124S085CIMMNO
U?#4 = REFERENCE SOT23 IN-OUT- GND: Generic Positive Voltage Reference; Manufacturer: Texas Instruments; Value: REF3130AIDBZTG4; Mouser No.: 595-REF3130AIDBZTG4

## Sheet FPGA-2.SchDoc
size A3; Date: Date; CompanyName: HESSO; Engineer: Name; Address1: Route du Rawyl 47; Address2: 1950 Sion; Address3: Switzerland; ProjectName: Project Name
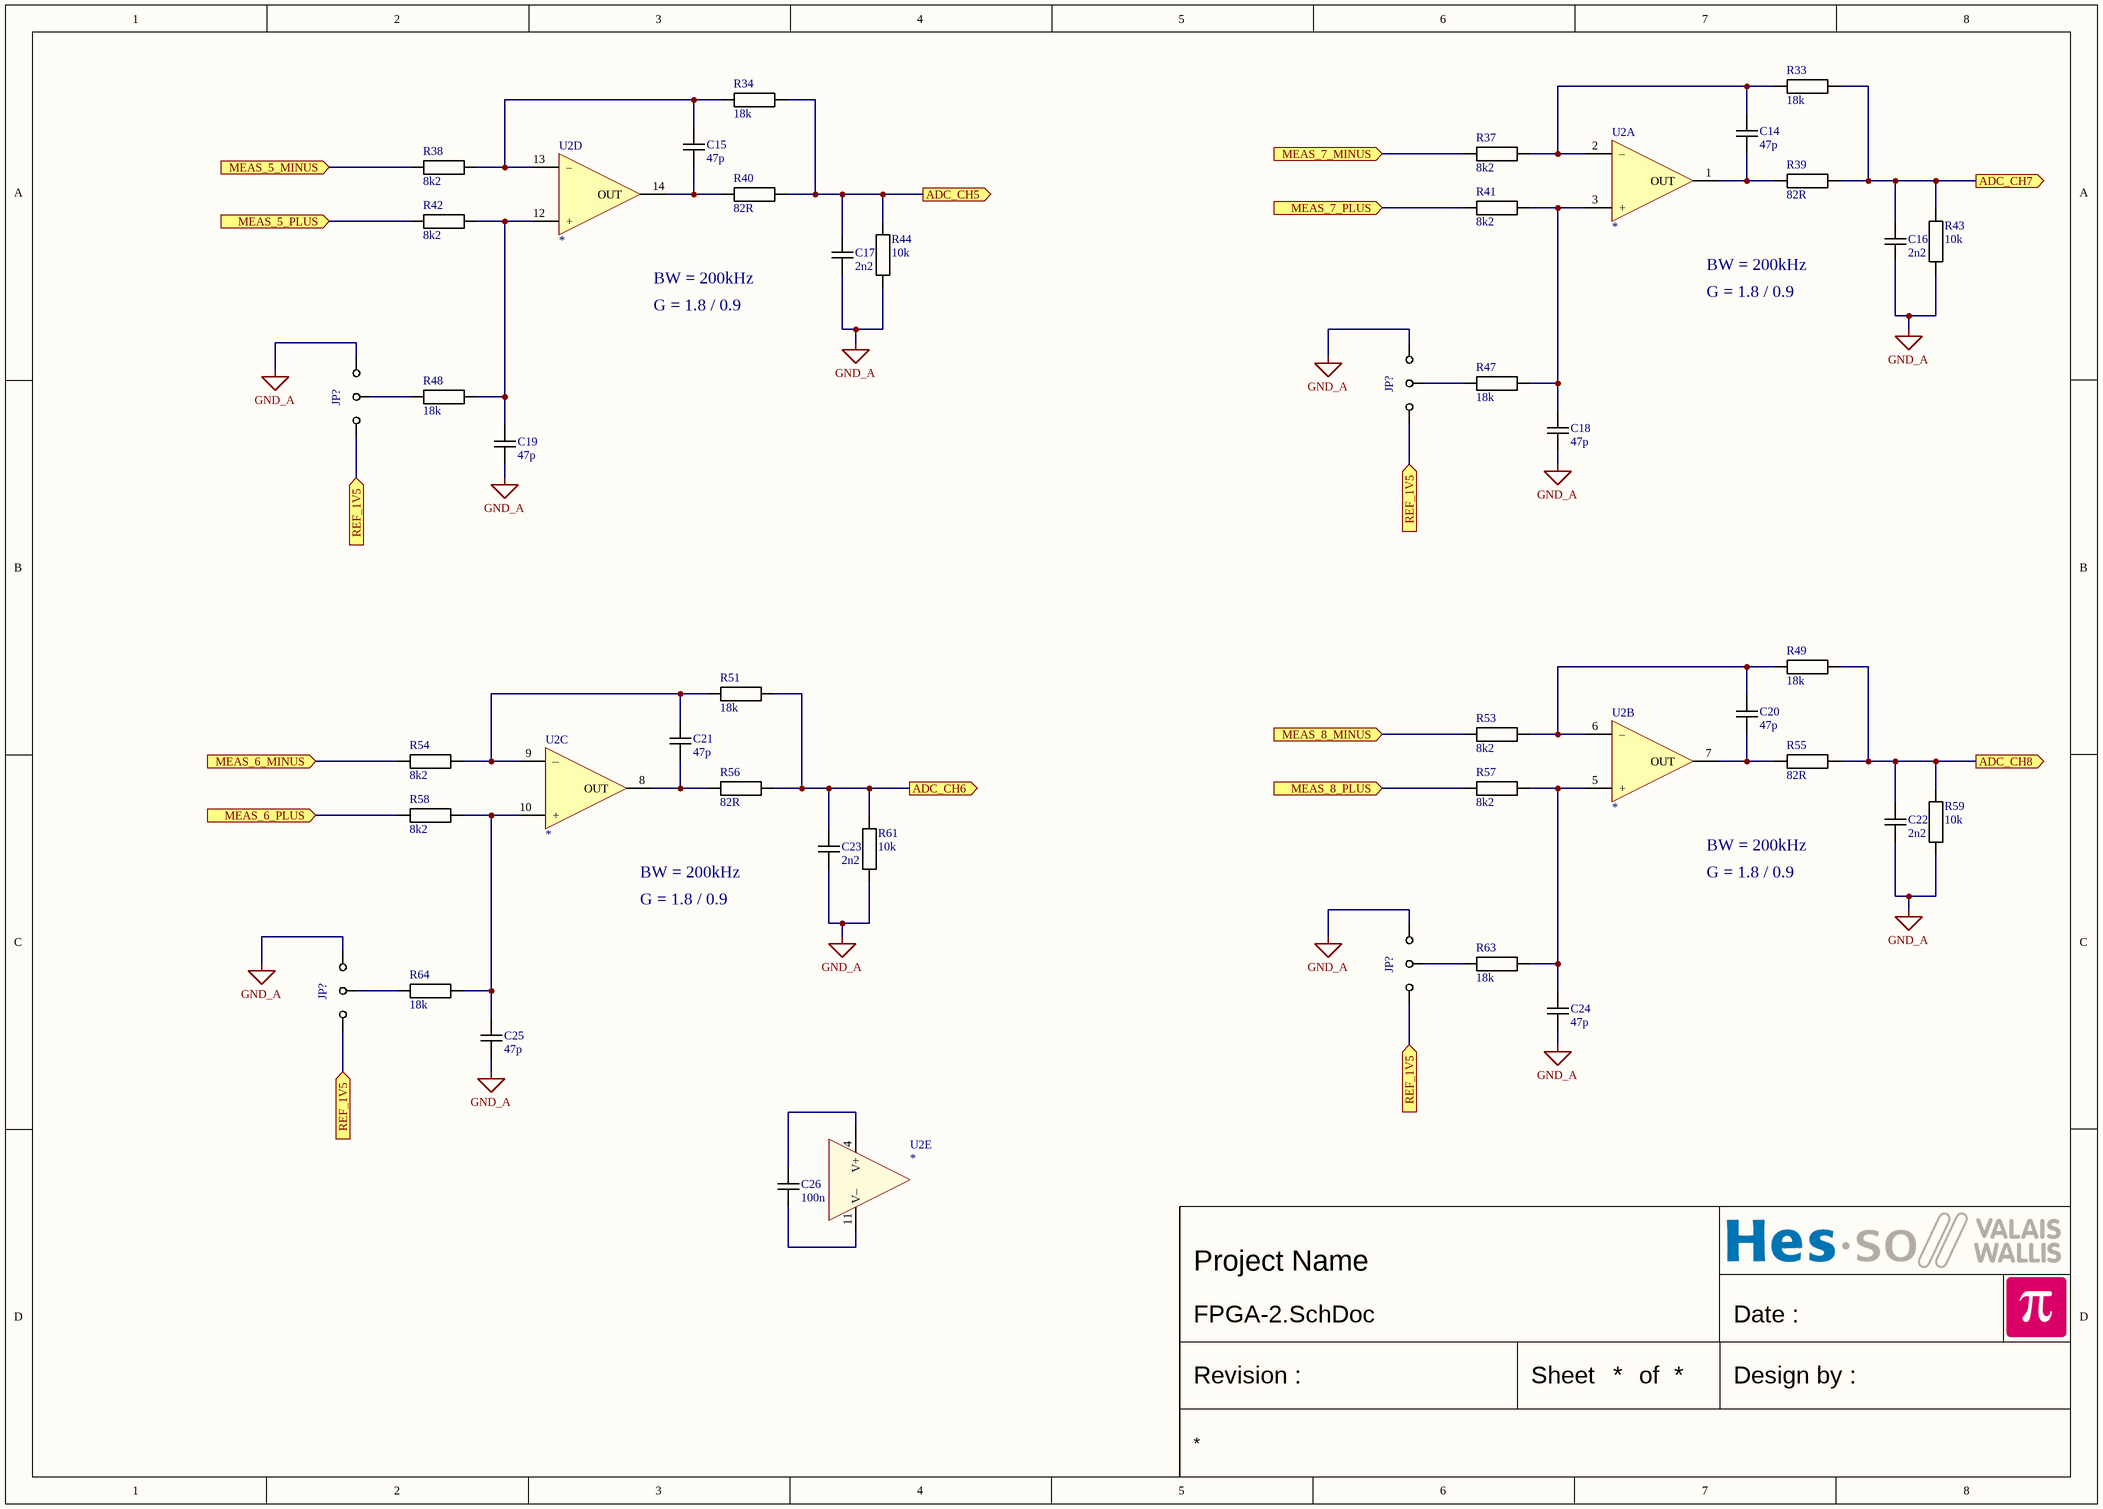
[diagram p4: FPGA-2.SchDoc]

### Parts
(Parts that share a designator on the sheet are numbered #1, #2 ... from top to bottom, then left to right.)
C14  47p  [CAPACITOR 1608 REFLOW]
C15  47p  [CAPACITOR 1608 REFLOW]
C16  2n2  [CAPACITOR 1608 REFLOW]
C17  2n2  [CAPACITOR 1608 REFLOW]
C18  47p  [CAPACITOR 1608 REFLOW]
C19  47p  [CAPACITOR 1608 REFLOW]
C20  47p  [CAPACITOR 1608 REFLOW]
C21  47p  [CAPACITOR 1608 REFLOW]
C22  2n2  [CAPACITOR 1608 REFLOW]
C23  2n2  [CAPACITOR 1608 REFLOW]
C24  47p  [CAPACITOR 1608 REFLOW]
C25  47p  [CAPACITOR 1608 REFLOW]
C26  100n  [CAPACITOR 1608 REFLOW]
JP?#5  {Value}  [JUMPER3 SMD 1608]  (value not drawn)
JP?#6  {Value}  [JUMPER3 SMD 1608]  (value not drawn)
JP?#7  {Value}  [JUMPER3 SMD 1608]  (value not drawn)
JP?#8  {Value}  [JUMPER3 SMD 1608]  (value not drawn)
R33  18k  [RESISTOR 1608 REFLOW]
R34  18k  [RESISTOR 1608 REFLOW]
R37  8k2  [RESISTOR 1608 REFLOW]
R38  8k2  [RESISTOR 1608 REFLOW]
R39  82R  [RESISTOR 1608 REFLOW]
R40  82R  [RESISTOR 1608 REFLOW]
R41  8k2  [RESISTOR 1608 REFLOW]
R42  8k2  [RESISTOR 1608 REFLOW]
R43  10k  [RESISTOR 1608 REFLOW]
R44  10k  [RESISTOR 1608 REFLOW]
R47  18k  [RESISTOR 1608 REFLOW]
R48  18k  [RESISTOR 1608 REFLOW]
R49  18k  [RESISTOR 1608 REFLOW]
R51  18k  [RESISTOR 1608 REFLOW]
R53  8k2  [RESISTOR 1608 REFLOW]
R54  8k2  [RESISTOR 1608 REFLOW]
R55  82R  [RESISTOR 1608 REFLOW]
R56  82R  [RESISTOR 1608 REFLOW]
R57  8k2  [RESISTOR 1608 REFLOW]
R58  8k2  [RESISTOR 1608 REFLOW]
R59  10k  [RESISTOR 1608 REFLOW]
R61  10k  [RESISTOR 1608 REFLOW]
R63  18k  [RESISTOR 1608 REFLOW]
R64  18k  [RESISTOR 1608 REFLOW]
U2  *  [SO14 P1.27 C4.0X8.8 H1.75]  (parts A,B,C,D,E of 5)

### Ports
ADC_CH5 (out), ADC_CH6 (out), ADC_CH7 (out), ADC_CH8 (out), MEAS_5_MINUS (in), MEAS_5_PLUS (in), MEAS_6_MINUS (in), MEAS_6_PLUS (in), MEAS_7_MINUS (in), MEAS_7_PLUS (in), MEAS_8_MINUS (in), MEAS_8_PLUS (in), REF_1V5 (in)

### Nets
GND_A: C16.1 C17.1 C18.1 C19.1 C22.1 C23.1 C24.1 C25.1 JP?#5.3 JP?#6.3 JP?#7.3 JP?#8.3 R43.2 R44.2 R59.2 R61.2
NetC14_1: C14.1 R39.1 U2.1(OUT)
NetC14_2: C14.2 R33.1 R37.2 U2.2(–)
NetC15_1: C15.1 R40.1 U2.14(OUT)
NetC15_2: C15.2 R34.1 R38.2 U2.13(–)
NetC16_2: C16.2 R33.2 R39.2 R43.1 ; port ADC_CH7
NetC17_2: C17.2 R34.2 R40.2 R44.1 ; port ADC_CH5
NetC18_2: C18.2 R41.2 R47.1 U2.3(+)
NetC19_2: C19.2 R42.2 R48.1 U2.12(+)
NetC20_1: C20.1 R55.1 U2.7(OUT)
NetC20_2: C20.2 R49.1 R53.2 U2.6(–)
NetC21_1: C21.1 R56.1 U2.8(OUT)
NetC21_2: C21.2 R51.1 R54.2 U2.9(–)
NetC22_2: C22.2 R49.2 R55.2 R59.1 ; port ADC_CH8
NetC23_2: C23.2 R51.2 R56.2 R61.1 ; port ADC_CH6
NetC24_2: C24.2 R57.2 R63.1 U2.5(+)
NetC25_2: C25.2 R58.2 R64.1 U2.10(+)
NetC26_1: C26.1 U2.11(V–)
NetC26_2: C26.2 U2.4(V+)
NetC106_2: JP?#5.1 JP?#6.1 JP?#7.1 JP?#8.1 ; port REF_1V5
NetJ9_11: R38.1 ; port MEAS_5_MINUS
NetJ9_12: R42.1 ; port MEAS_5_PLUS
NetJ9_13: R54.1 ; port MEAS_6_MINUS
NetJ9_14: R58.1 ; port MEAS_6_PLUS
NetJ9_15: R37.1 ; port MEAS_7_MINUS
NetJ9_16: R41.1 ; port MEAS_7_PLUS
NetJ9_17: R53.1 ; port MEAS_8_MINUS
NetJ9_18: R57.1 ; port MEAS_8_PLUS
NetJP?#5_2: JP?#5.2 R47.2
NetJP?#6_2: JP?#6.2 R48.2
NetJP?#7_2: JP?#7.2 R63.2
NetJP?#8_2: JP?#8.2 R64.2

### Notes on the sheet
- BW = 200kHz
- G = 1.8 / 0.9
- Date :
- Revision :
- Sheet
- of
- Design by :

### Library data of the parts
C14-C26 = Capacitor: Capacitor X7R 10% 50V 1608(0603)
  C14 C15 C18-C21 C24 C25: Value: 47p
  C16 C17 C22 C23: Value: 2n2
  C26: Value: 100n
JP?#5-JP?#8 = JUMPER 3 POS: Value: {Value}
R33 R34 R37-R44 R47-R49 R51 R53-R59 R61 R63 R64 = Resistor: Resistor 1% 50V 100mW 1608(0603)
  R33 R34 R47-R49 R51 R63 R64: Value: 18k
  R37 R38 R41 R42 R53 R54 R57 R58: Value: 8k2
  R39 R40 R55 R56: Value: 82R
  R43 R44 R59 R61: Value: 10k
U2 = OPA QUAD: Generic quad OPA 14 pins; Value: *

## Sheet FPGA-3.SchDoc
size A3; Date: Date; CompanyName: HESSO; Engineer: Name; Address1: Route du Rawyl 47; Address2: 1950 Sion; Address3: Switzerland; ProjectName: Project Name
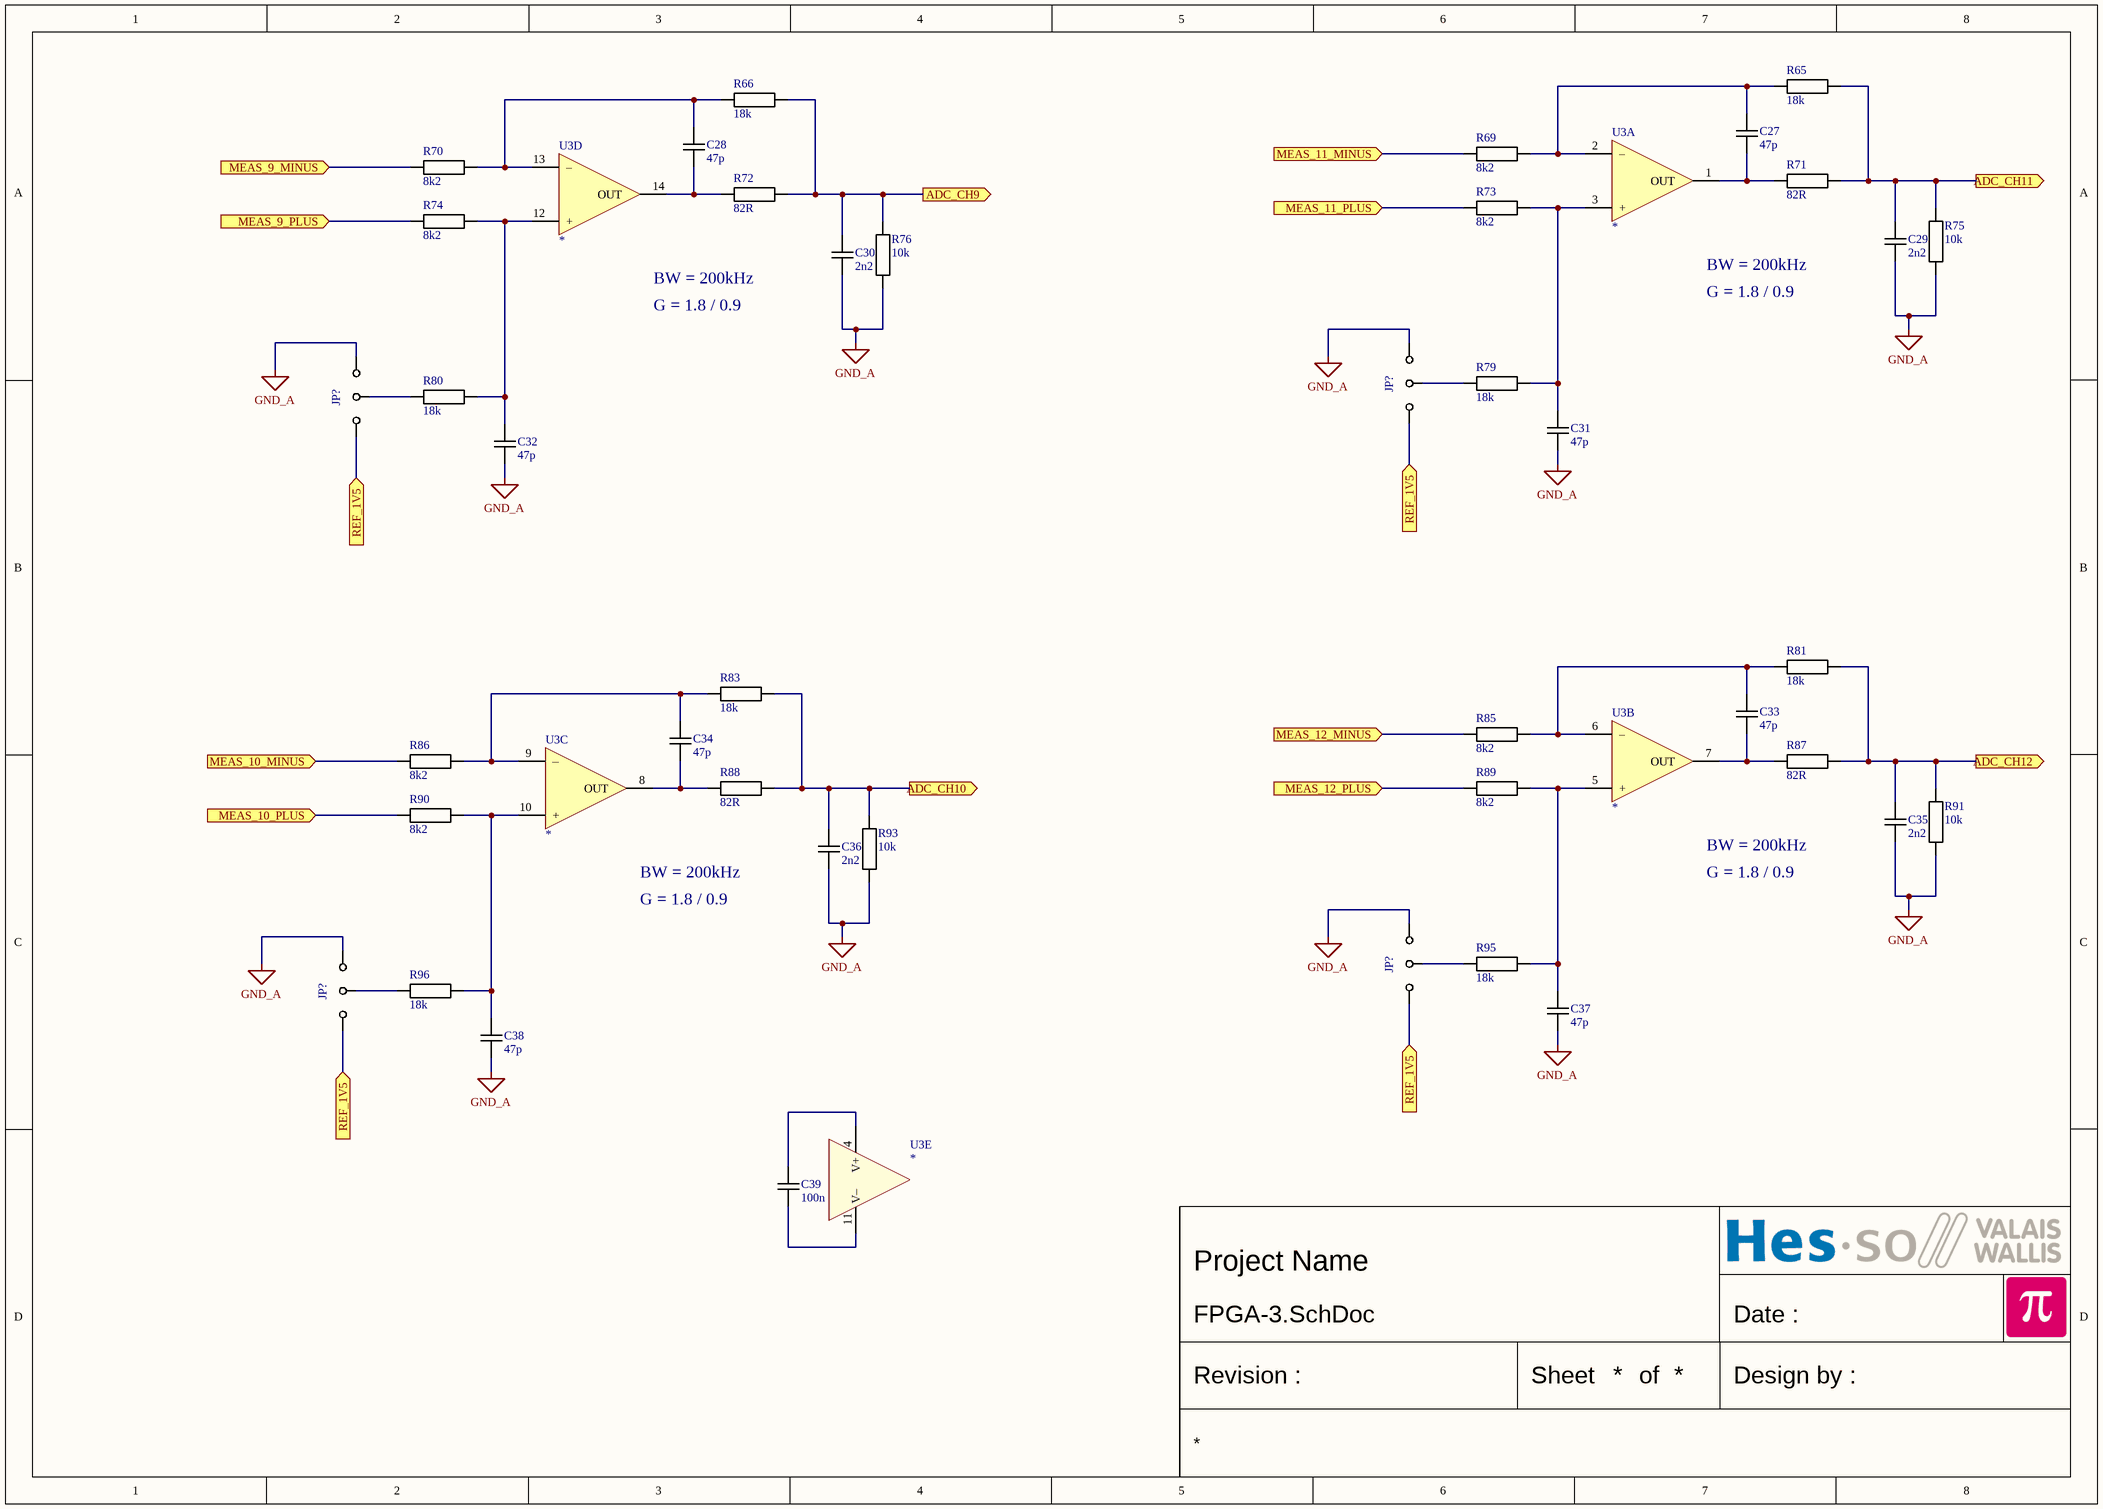
[diagram p5: FPGA-3.SchDoc]

### Parts
(Parts that share a designator on the sheet are numbered #1, #2 ... from top to bottom, then left to right.)
C27  47p  [CAPACITOR 1608 REFLOW]
C28  47p  [CAPACITOR 1608 REFLOW]
C29  2n2  [CAPACITOR 1608 REFLOW]
C30  2n2  [CAPACITOR 1608 REFLOW]
C31  47p  [CAPACITOR 1608 REFLOW]
C32  47p  [CAPACITOR 1608 REFLOW]
C33  47p  [CAPACITOR 1608 REFLOW]
C34  47p  [CAPACITOR 1608 REFLOW]
C35  2n2  [CAPACITOR 1608 REFLOW]
C36  2n2  [CAPACITOR 1608 REFLOW]
C37  47p  [CAPACITOR 1608 REFLOW]
C38  47p  [CAPACITOR 1608 REFLOW]
C39  100n  [CAPACITOR 1608 REFLOW]
JP?#9  {Value}  [JUMPER3 SMD 1608]  (value not drawn)
JP?#10  {Value}  [JUMPER3 SMD 1608]  (value not drawn)
JP?#11  {Value}  [JUMPER3 SMD 1608]  (value not drawn)
JP?#12  {Value}  [JUMPER3 SMD 1608]  (value not drawn)
R65  18k  [RESISTOR 1608 REFLOW]
R66  18k  [RESISTOR 1608 REFLOW]
R69  8k2  [RESISTOR 1608 REFLOW]
R70  8k2  [RESISTOR 1608 REFLOW]
R71  82R  [RESISTOR 1608 REFLOW]
R72  82R  [RESISTOR 1608 REFLOW]
R73#1  8k2  [RESISTOR 1608 REFLOW]
R74#1  8k2  [RESISTOR 1608 REFLOW]
R75#1  10k  [RESISTOR 1608 REFLOW]
R76#1  10k  [RESISTOR 1608 REFLOW]
R79#1  18k  [RESISTOR 1608 REFLOW]
R80#1  18k  [RESISTOR 1608 REFLOW]
R81#1  18k  [RESISTOR 1608 REFLOW]
R83#1  18k  [RESISTOR 1608 REFLOW]
R85#1  8k2  [RESISTOR 1608 REFLOW]
R86#1  8k2  [RESISTOR 1608 REFLOW]
R87#1  82R  [RESISTOR 1608 REFLOW]
R88#1  82R  [RESISTOR 1608 REFLOW]
R89#1  8k2  [RESISTOR 1608 REFLOW]
R90#1  8k2  [RESISTOR 1608 REFLOW]
R91#1  10k  [RESISTOR 1608 REFLOW]
R93#1  10k  [RESISTOR 1608 REFLOW]
R95#1  18k  [RESISTOR 1608 REFLOW]
R96#1  18k  [RESISTOR 1608 REFLOW]
U3  *  [SO14 P1.27 C4.0X8.8 H1.75]  (parts A,B,C,D,E of 5)

### Ports
ADC_CH9 (out), ADC_CH10 (out), ADC_CH11 (out), ADC_CH12 (out), MEAS_9_MINUS (in), MEAS_9_PLUS (in), MEAS_10_MINUS (in), MEAS_10_PLUS (in), MEAS_11_MINUS (in), MEAS_11_PLUS (in), MEAS_12_MINUS (in), MEAS_12_PLUS (in), REF_1V5 (in)

### Nets
GND_A: C29.1 C30.1 C31.1 C32.1 C35.1 C36.1 C37.1 C38.1 JP?#9.3 JP?#10.3 JP?#11.3 JP?#12.3 R75#1.2 R76#1.2 R91#1.2 R93#1.2
NetC27_1: C27.1 R71.1 U3.1(OUT)
NetC27_2: C27.2 R65.1 R69.2 U3.2(–)
NetC28_1: C28.1 R72.1 U3.14(OUT)
NetC28_2: C28.2 R66.1 R70.2 U3.13(–)
NetC29_2: C29.2 R65.2 R71.2 R75#1.1 ; port ADC_CH11
NetC30_2: C30.2 R66.2 R72.2 R76#1.1 ; port ADC_CH9
NetC31_2: C31.2 R73#1.2 R79#1.1 U3.3(+)
NetC32_2: C32.2 R74#1.2 R80#1.1 U3.12(+)
NetC33_1: C33.1 R87#1.1 U3.7(OUT)
NetC33_2: C33.2 R81#1.1 R85#1.2 U3.6(–)
NetC34_1: C34.1 R88#1.1 U3.8(OUT)
NetC34_2: C34.2 R83#1.1 R86#1.2 U3.9(–)
NetC35_2: C35.2 R81#1.2 R87#1.2 R91#1.1 ; port ADC_CH12
NetC36_2: C36.2 R83#1.2 R88#1.2 R93#1.1 ; port ADC_CH10
NetC37_2: C37.2 R89#1.2 R95#1.1 U3.5(+)
NetC38_2: C38.2 R90#1.2 R96#1.1 U3.10(+)
NetC39_1: C39.1 U3.11(V–)
NetC39_2: C39.2 U3.4(V+)
NetC106_2: JP?#9.1 JP?#10.1 JP?#11.1 JP?#12.1 ; port REF_1V5
NetJ9_19: R70.1 ; port MEAS_9_MINUS
NetJ9_20: R74#1.1 ; port MEAS_9_PLUS
NetJ10_1: R86#1.1 ; port MEAS_10_MINUS
NetJ10_2: R90#1.1 ; port MEAS_10_PLUS
NetJ10_3: R69.1 ; port MEAS_11_MINUS
NetJ10_4: R73#1.1 ; port MEAS_11_PLUS
NetJ10_5: R85#1.1 ; port MEAS_12_MINUS
NetJ10_6: R89#1.1 ; port MEAS_12_PLUS
NetJP?#9_2: JP?#9.2 R79#1.2
NetJP?#10_2: JP?#10.2 R80#1.2
NetJP?#11_2: JP?#11.2 R95#1.2
NetJP?#12_2: JP?#12.2 R96#1.2

### Notes on the sheet
- BW = 200kHz
- G = 1.8 / 0.9
- Date :
- Revision :
- Sheet
- of
- Design by :

### Library data of the parts
C27-C39 = Capacitor: Capacitor X7R 10% 50V 1608(0603)
  C27 C28 C31-C34 C37 C38: Value: 47p
  C29 C30 C35 C36: Value: 2n2
  C39: Value: 100n
JP?#9-JP?#12 = JUMPER 3 POS: Value: {Value}
R65 R66 R69-R72 R73#1 R74#1 R75#1 R76#1 R79#1 R80#1 R81#1 R83#1 R85#1 R86#1 R87#1 R88#1 R89#1 R90#1 R91#1 R93#1 R95#1 R96#1 = Resistor: Resistor 1% 50V 100mW 1608(0603)
  R65 R66 R79#1 R80#1 R81#1 R83#1 R95#1 R96#1: Value: 18k
  R69 R70 R73#1 R74#1 R85#1 R86#1 R89#1 R90#1: Value: 8k2
  R71 R72 R87#1 R88#1: Value: 82R
  R75#1 R76#1 R91#1 R93#1: Value: 10k
U3 = OPA QUAD: Generic quad OPA 14 pins; Value: *

## Sheet FPGA-4.SchDoc
size A3; Date: Date; CompanyName: HESSO; Engineer: Name; Address1: Route du Rawyl 47; Address2: 1950 Sion; Address3: Switzerland; ProjectName: Project Name
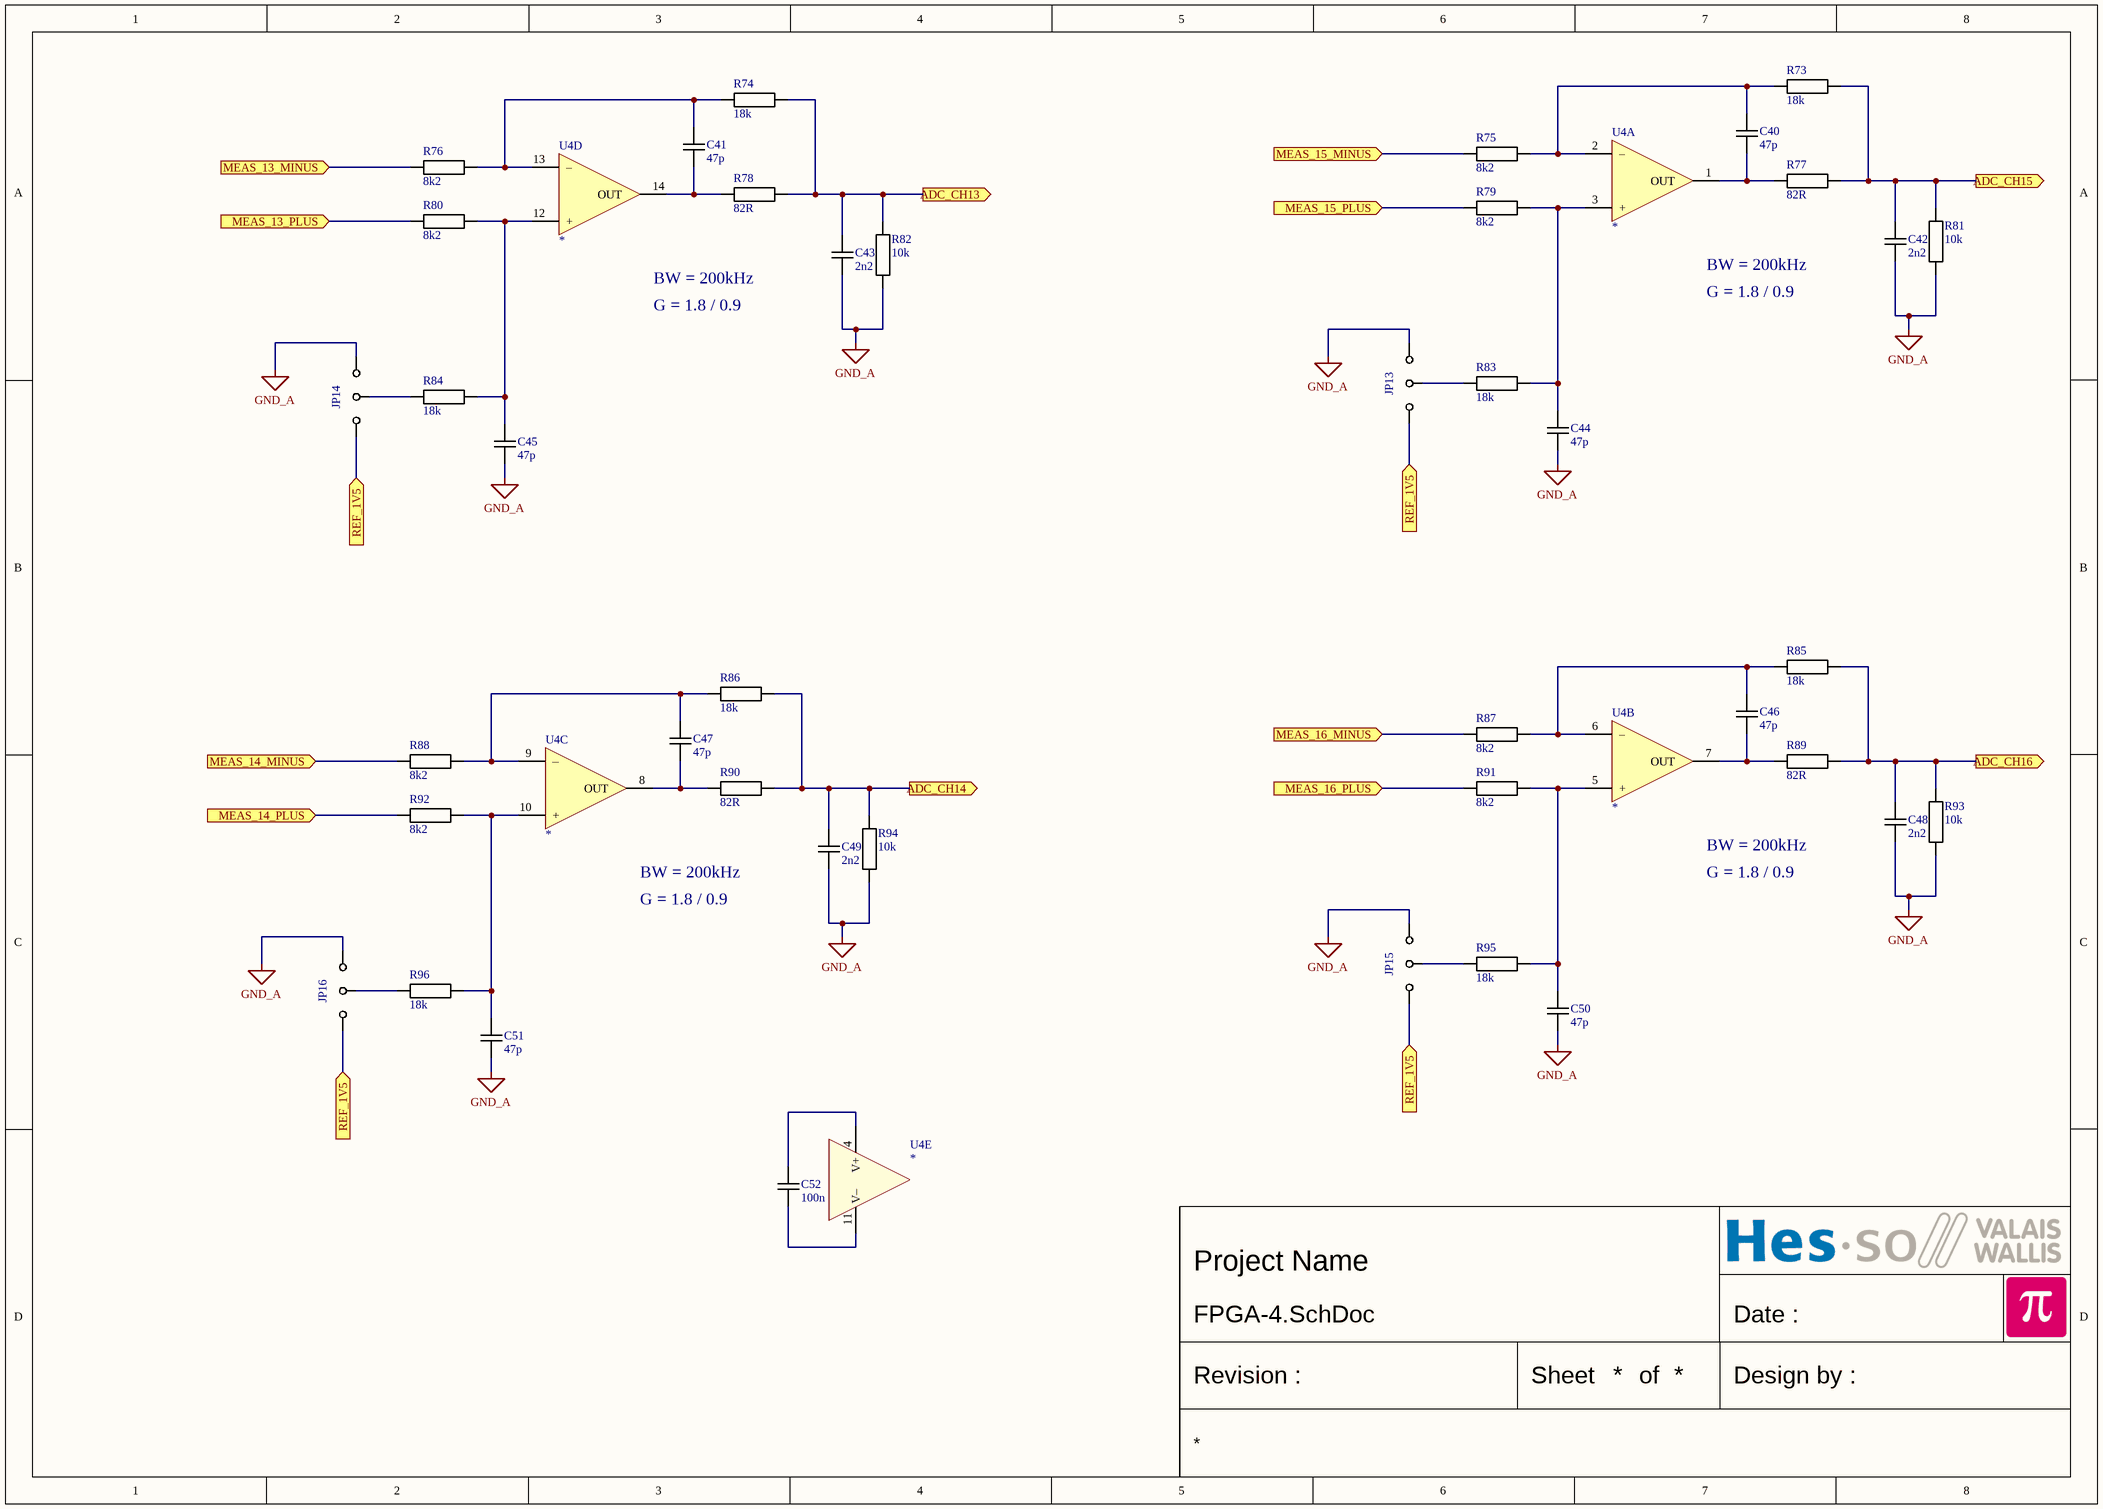
[diagram p6: FPGA-4.SchDoc]

### Parts
(Parts that share a designator on the sheet are numbered #1, #2 ... from top to bottom, then left to right.)
C40  47p  [CAPACITOR 1608 REFLOW]
C41  47p  [CAPACITOR 1608 REFLOW]
C42  2n2  [CAPACITOR 1608 REFLOW]
C43  2n2  [CAPACITOR 1608 REFLOW]
C44  47p  [CAPACITOR 1608 REFLOW]
C45  47p  [CAPACITOR 1608 REFLOW]
C46  47p  [CAPACITOR 1608 REFLOW]
C47  47p  [CAPACITOR 1608 REFLOW]
C48  2n2  [CAPACITOR 1608 REFLOW]
C49  2n2  [CAPACITOR 1608 REFLOW]
C50  47p  [CAPACITOR 1608 REFLOW]
C51  47p  [CAPACITOR 1608 REFLOW]
C52  100n  [CAPACITOR 1608 REFLOW]
JP13  {Value}  [JUMPER3 SMD 1608]  (value not drawn)
JP14  {Value}  [JUMPER3 SMD 1608]  (value not drawn)
JP15  {Value}  [JUMPER3 SMD 1608]  (value not drawn)
JP16  {Value}  [JUMPER3 SMD 1608]  (value not drawn)
R73#2  18k  [RESISTOR 1608 REFLOW]
R74#2  18k  [RESISTOR 1608 REFLOW]
R75#2  8k2  [RESISTOR 1608 REFLOW]
R76#2  8k2  [RESISTOR 1608 REFLOW]
R77  82R  [RESISTOR 1608 REFLOW]
R78  82R  [RESISTOR 1608 REFLOW]
R79#2  8k2  [RESISTOR 1608 REFLOW]
R80#2  8k2  [RESISTOR 1608 REFLOW]
R81#2  10k  [RESISTOR 1608 REFLOW]
R82  10k  [RESISTOR 1608 REFLOW]
R83#2  18k  [RESISTOR 1608 REFLOW]
R84  18k  [RESISTOR 1608 REFLOW]
R85#2  18k  [RESISTOR 1608 REFLOW]
R86#2  18k  [RESISTOR 1608 REFLOW]
R87#2  8k2  [RESISTOR 1608 REFLOW]
R88#2  8k2  [RESISTOR 1608 REFLOW]
R89#2  82R  [RESISTOR 1608 REFLOW]
R90#2  82R  [RESISTOR 1608 REFLOW]
R91#2  8k2  [RESISTOR 1608 REFLOW]
R92  8k2  [RESISTOR 1608 REFLOW]
R93#2  10k  [RESISTOR 1608 REFLOW]
R94  10k  [RESISTOR 1608 REFLOW]
R95#2  18k  [RESISTOR 1608 REFLOW]
R96#2  18k  [RESISTOR 1608 REFLOW]
U4  *  [SO14 P1.27 C4.0X8.8 H1.75]  (parts A,B,C,D,E of 5)

### Ports
ADC_CH13 (out), ADC_CH14 (out), ADC_CH15 (out), ADC_CH16 (out), MEAS_13_MINUS (in), MEAS_13_PLUS (in), MEAS_14_MINUS (in), MEAS_14_PLUS (in), MEAS_15_MINUS (in), MEAS_15_PLUS (in), MEAS_16_MINUS (in), MEAS_16_PLUS (in), REF_1V5 (in)

### Nets
GND_A: C42.1 C43.1 C44.1 C45.1 C48.1 C49.1 C50.1 C51.1 JP13.3 JP14.3 JP15.3 JP16.3 R81#2.2 R82.2 R93#2.2 R94.2
NetC40_1: C40.1 R77.1 U4.1(OUT)
NetC40_2: C40.2 R73#2.1 R75#2.2 U4.2(–)
NetC41_1: C41.1 R78.1 U4.14(OUT)
NetC41_2: C41.2 R74#2.1 R76#2.2 U4.13(–)
NetC42_2: C42.2 R73#2.2 R77.2 R81#2.1 ; port ADC_CH15
NetC43_2: C43.2 R74#2.2 R78.2 R82.1 ; port ADC_CH13
NetC44_2: C44.2 R79#2.2 R83#2.1 U4.3(+)
NetC45_2: C45.2 R80#2.2 R84.1 U4.12(+)
NetC46_1: C46.1 R89#2.1 U4.7(OUT)
NetC46_2: C46.2 R85#2.1 R87#2.2 U4.6(–)
NetC47_1: C47.1 R90#2.1 U4.8(OUT)
NetC47_2: C47.2 R86#2.1 R88#2.2 U4.9(–)
NetC48_2: C48.2 R85#2.2 R89#2.2 R93#2.1 ; port ADC_CH16
NetC49_2: C49.2 R86#2.2 R90#2.2 R94.1 ; port ADC_CH14
NetC50_2: C50.2 R91#2.2 R95#2.1 U4.5(+)
NetC51_2: C51.2 R92.2 R96#2.1 U4.10(+)
NetC52_1: C52.1 U4.11(V–)
NetC52_2: C52.2 U4.4(V+)
NetC106_2: JP13.1 JP14.1 JP15.1 JP16.1 ; port REF_1V5
NetJ10_7: R76#2.1 ; port MEAS_13_MINUS
NetJ10_8: R80#2.1 ; port MEAS_13_PLUS
NetJ10_9: R88#2.1 ; port MEAS_14_MINUS
NetJ10_10: R92.1 ; port MEAS_14_PLUS
NetJ10_11: R75#2.1 ; port MEAS_15_MINUS
NetJ10_12: R79#2.1 ; port MEAS_15_PLUS
NetJ10_13: R87#2.1 ; port MEAS_16_MINUS
NetJ10_14: R91#2.1 ; port MEAS_16_PLUS
NetJP13_2: JP13.2 R83#2.2
NetJP14_2: JP14.2 R84.2
NetJP15_2: JP15.2 R95#2.2
NetJP16_2: JP16.2 R96#2.2

### Notes on the sheet
- BW = 200kHz
- G = 1.8 / 0.9
- Date :
- Revision :
- Sheet
- of
- Design by :

### Library data of the parts
C40-C52 = Capacitor: Capacitor X7R 10% 50V 1608(0603)
  C40 C41 C44-C47 C50 C51: Value: 47p
  C42 C43 C48 C49: Value: 2n2
  C52: Value: 100n
JP13-JP16 = JUMPER 3 POS: Value: {Value}
R73#2 R74#2 R75#2 R76#2 R77 R78 R79#2 R80#2 R81#2 R82 R83#2 R84 R85#2 R86#2 R87#2 R88#2 R89#2 R90#2 R91#2 R92 R93#2 R94 R95#2 R96#2 = Resistor: Resistor 1% 50V 100mW 1608(0603)
  R73#2 R74#2 R83#2 R84 R85#2 R86#2 R95#2 R96#2: Value: 18k
  R75#2 R76#2 R79#2 R80#2 R87#2 R88#2 R91#2 R92: Value: 8k2
  R77 R78 R89#2 R90#2: Value: 82R
  R81#2 R82 R93#2 R94: Value: 10k
U4 = OPA QUAD: Generic quad OPA 14 pins; Value: *

## Sheet FPGA-5.SchDoc
size A3; Date: Date; CompanyName: HESSO; Engineer: Name; Address1: Route du Rawyl 47; Address2: 1950 Sion; Address3: Switzerland; ProjectName: Project Name
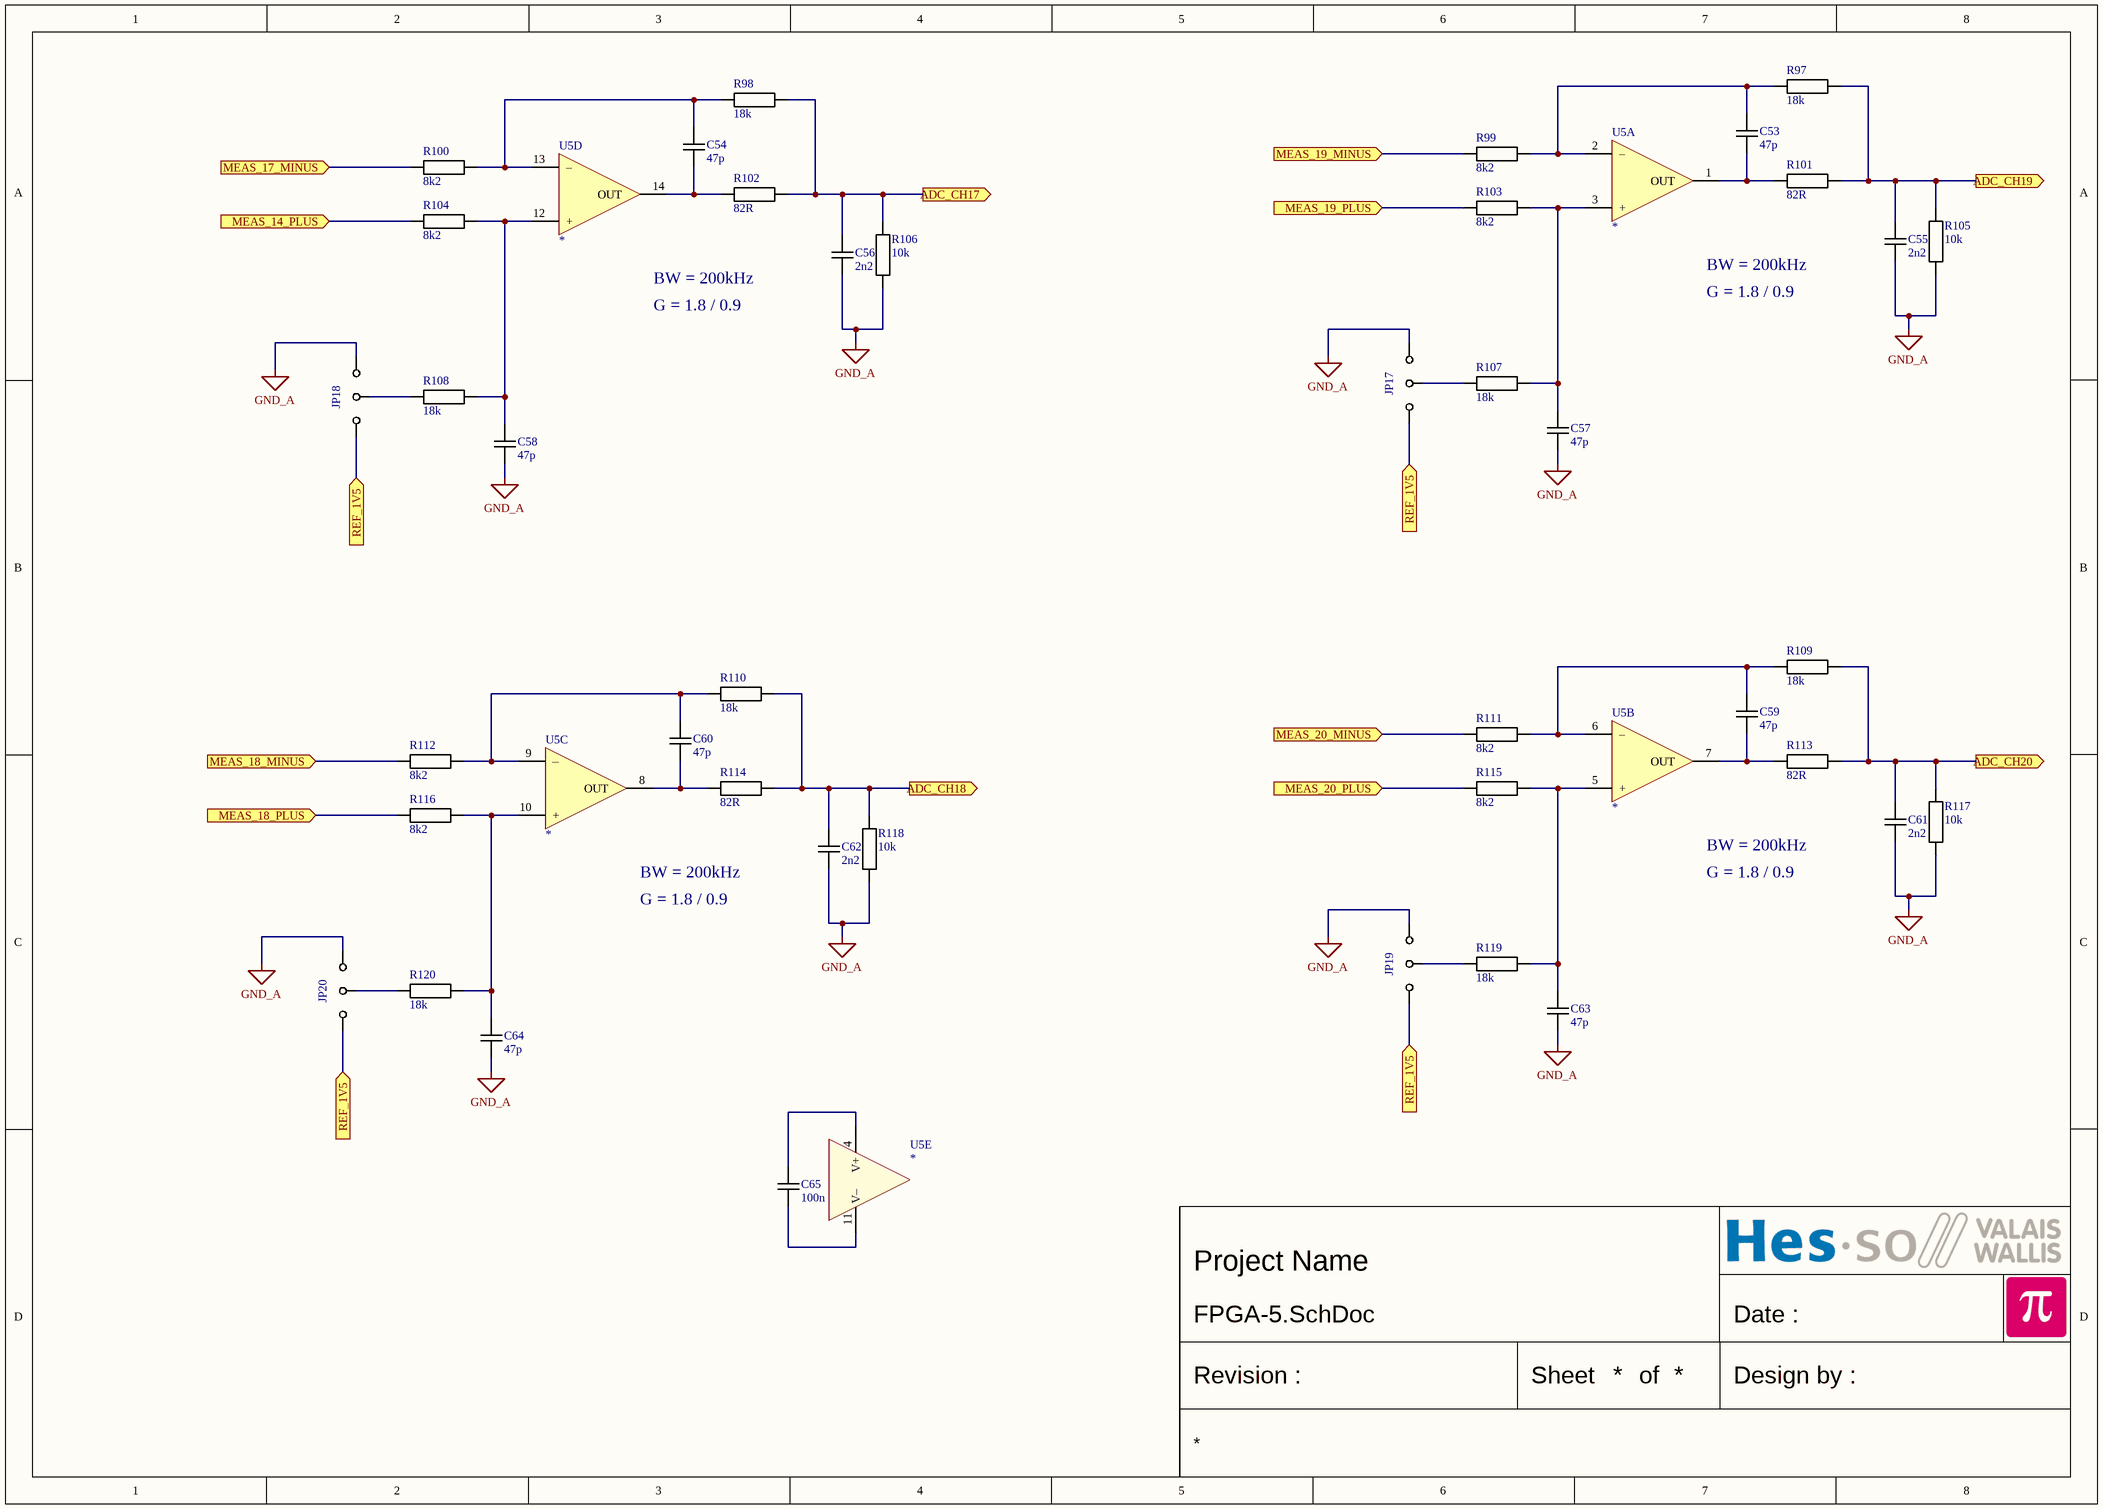
[diagram p7: FPGA-5.SchDoc]

### Parts
C53  47p  [CAPACITOR 1608 REFLOW]
C54  47p  [CAPACITOR 1608 REFLOW]
C55  2n2  [CAPACITOR 1608 REFLOW]
C56  2n2  [CAPACITOR 1608 REFLOW]
C57  47p  [CAPACITOR 1608 REFLOW]
C58  47p  [CAPACITOR 1608 REFLOW]
C59  47p  [CAPACITOR 1608 REFLOW]
C60  47p  [CAPACITOR 1608 REFLOW]
C61  2n2  [CAPACITOR 1608 REFLOW]
C62  2n2  [CAPACITOR 1608 REFLOW]
C63  47p  [CAPACITOR 1608 REFLOW]
C64  47p  [CAPACITOR 1608 REFLOW]
C65  100n  [CAPACITOR 1608 REFLOW]
JP17  {Value}  [JUMPER3 SMD 1608]  (value not drawn)
JP18  {Value}  [JUMPER3 SMD 1608]  (value not drawn)
JP19  {Value}  [JUMPER3 SMD 1608]  (value not drawn)
JP20  {Value}  [JUMPER3 SMD 1608]  (value not drawn)
R97  18k  [RESISTOR 1608 REFLOW]
R98  18k  [RESISTOR 1608 REFLOW]
R99  8k2  [RESISTOR 1608 REFLOW]
R100  8k2  [RESISTOR 1608 REFLOW]
R101  82R  [RESISTOR 1608 REFLOW]
R102  82R  [RESISTOR 1608 REFLOW]
R103  8k2  [RESISTOR 1608 REFLOW]
R104  8k2  [RESISTOR 1608 REFLOW]
R105  10k  [RESISTOR 1608 REFLOW]
R106  10k  [RESISTOR 1608 REFLOW]
R107  18k  [RESISTOR 1608 REFLOW]
R108  18k  [RESISTOR 1608 REFLOW]
R109  18k  [RESISTOR 1608 REFLOW]
R110  18k  [RESISTOR 1608 REFLOW]
R111  8k2  [RESISTOR 1608 REFLOW]
R112  8k2  [RESISTOR 1608 REFLOW]
R113  82R  [RESISTOR 1608 REFLOW]
R114  82R  [RESISTOR 1608 REFLOW]
R115  8k2  [RESISTOR 1608 REFLOW]
R116  8k2  [RESISTOR 1608 REFLOW]
R117  10k  [RESISTOR 1608 REFLOW]
R118  10k  [RESISTOR 1608 REFLOW]
R119  18k  [RESISTOR 1608 REFLOW]
R120  18k  [RESISTOR 1608 REFLOW]
U5  *  [SO14 P1.27 C4.0X8.8 H1.75]  (parts A,B,C,D,E of 5)

### Ports
ADC_CH17 (out), ADC_CH18 (out), ADC_CH19 (out), ADC_CH20 (out), MEAS_14_PLUS (in), MEAS_17_MINUS (in), MEAS_18_MINUS (in), MEAS_18_PLUS (in), MEAS_19_MINUS (in), MEAS_19_PLUS (in), MEAS_20_MINUS (in), MEAS_20_PLUS (in), REF_1V5 (in)

### Nets
GND_A: C55.1 C56.1 C57.1 C58.1 C61.1 C62.1 C63.1 C64.1 JP17.3 JP18.3 JP19.3 JP20.3 R105.2 R106.2 R117.2 R118.2
NetC53_1: C53.1 R101.1 U5.1(OUT)
NetC53_2: C53.2 R97.1 R99.2 U5.2(–)
NetC54_1: C54.1 R102.1 U5.14(OUT)
NetC54_2: C54.2 R98.1 R100.2 U5.13(–)
NetC55_2: C55.2 R97.2 R101.2 R105.1 ; port ADC_CH19
NetC56_2: C56.2 R98.2 R102.2 R106.1 ; port ADC_CH17
NetC57_2: C57.2 R103.2 R107.1 U5.3(+)
NetC58_2: C58.2 R104.2 R108.1 U5.12(+)
NetC59_1: C59.1 R113.1 U5.7(OUT)
NetC59_2: C59.2 R109.1 R111.2 U5.6(–)
NetC60_1: C60.1 R114.1 U5.8(OUT)
NetC60_2: C60.2 R110.1 R112.2 U5.9(–)
NetC61_2: C61.2 R109.2 R113.2 R117.1 ; port ADC_CH20
NetC62_2: C62.2 R110.2 R114.2 R118.1 ; port ADC_CH18
NetC63_2: C63.2 R115.2 R119.1 U5.5(+)
NetC64_2: C64.2 R116.2 R120.1 U5.10(+)
NetC65_1: C65.1 U5.11(V–)
NetC65_2: C65.2 U5.4(V+)
NetC106_2: JP17.1 JP18.1 JP19.1 JP20.1 ; port REF_1V5
NetJ10_10: R104.1 ; port MEAS_14_PLUS
NetJ10_15: R100.1 ; port MEAS_17_MINUS
NetJ10_17: R112.1 ; port MEAS_18_MINUS
NetJ10_18: R116.1 ; port MEAS_18_PLUS
NetJ10_19: R99.1 ; port MEAS_19_MINUS
NetJ10_20: R103.1 ; port MEAS_19_PLUS
NetJP17_2: JP17.2 R107.2
NetJP18_2: JP18.2 R108.2
NetJP19_2: JP19.2 R119.2
NetJP20_2: JP20.2 R120.2
NetR111_1: R111.1 ; port MEAS_20_MINUS
NetR115_1: R115.1 ; port MEAS_20_PLUS

### Notes on the sheet
- BW = 200kHz
- G = 1.8 / 0.9
- Date :
- Revision :
- Sheet
- of
- Design by :

### Library data of the parts
C53-C65 = Capacitor: Capacitor X7R 10% 50V 1608(0603)
  C53 C54 C57-C60 C63 C64: Value: 47p
  C55 C56 C61 C62: Value: 2n2
  C65: Value: 100n
JP17-JP20 = JUMPER 3 POS: Value: {Value}
R97-R120 = Resistor: Resistor 1% 50V 100mW 1608(0603)
  R97 R98 R107-R110 R119 R120: Value: 18k
  R99 R100 R103 R104 R111 R112 R115 R116: Value: 8k2
  R101 R102 R113 R114: Value: 82R
  R105 R106 R117 R118: Value: 10k
U5 = OPA QUAD: Generic quad OPA 14 pins; Value: *

## Sheet FPGA-6.SchDoc
size A3; Date: Date; CompanyName: HESSO; Engineer: Name; Address1: Route du Rawyl 47; Address2: 1950 Sion; Address3: Switzerland; ProjectName: Project Name
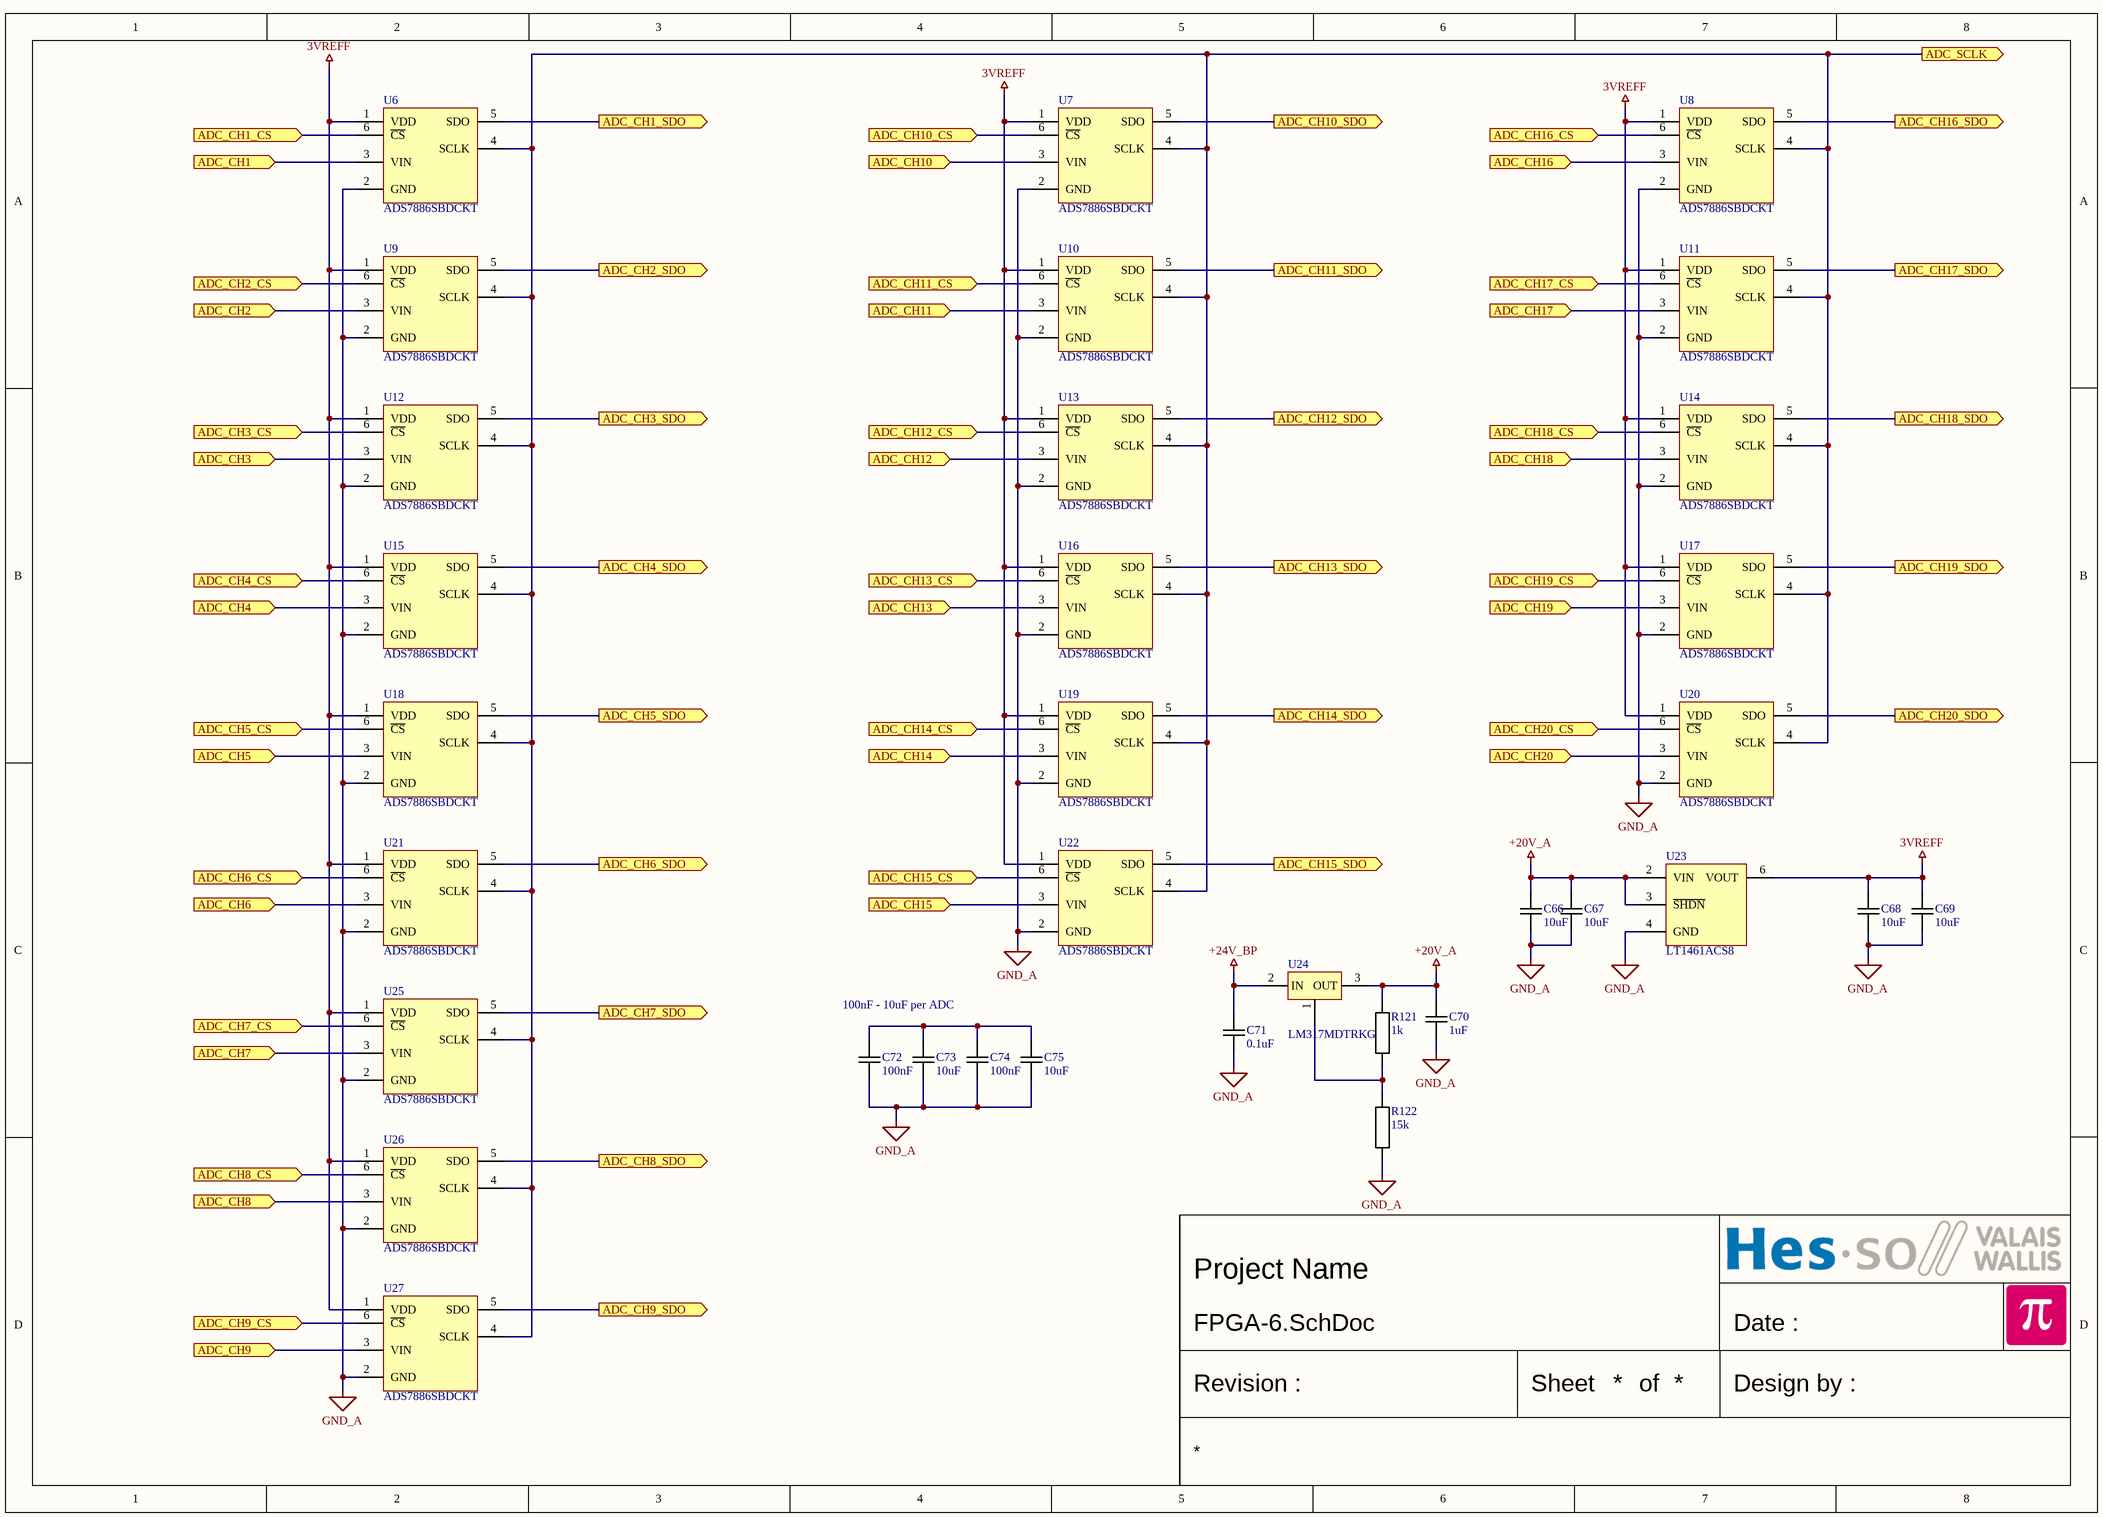
[diagram p8: FPGA-6.SchDoc]

### Parts
C66  10uF  [CAPACITOR 1608 REFLOW]
C67  10uF  [CAPACITOR 1608 REFLOW]
C68  10uF  [CAPACITOR 1608 REFLOW]
C69  10uF  [CAPACITOR 1608 REFLOW]
C70  1uF  [CAPACITOR 1608 REFLOW]
C71  0.1uF  [CAPACITOR 1608 REFLOW]
C72  100nF  [CAPACITOR 1005 REFLOW]
C73  10uF  [CAPACITOR 1608 REFLOW]
C74  100nF  [CAPACITOR 1005 REFLOW]
C75  10uF  [CAPACITOR 1608 REFLOW]
R121  1k  [RESISTOR 1608 REFLOW]
R122  15k  [RESISTOR 1608 REFLOW]
U6  ADS7886SBDCKT  [SOT23-6 P0.95 C1.5x3.0 H1.3]
U7  ADS7886SBDCKT  [SOT23-6 P0.95 C1.5x3.0 H1.3]
U8  ADS7886SBDCKT  [SOT23-6 P0.95 C1.5x3.0 H1.3]
U9  ADS7886SBDCKT  [SOT23-6 P0.95 C1.5x3.0 H1.3]
U10  ADS7886SBDCKT  [SOT23-6 P0.95 C1.5x3.0 H1.3]
U11  ADS7886SBDCKT  [SOT23-6 P0.95 C1.5x3.0 H1.3]
U12  ADS7886SBDCKT  [SOT23-6 P0.95 C1.5x3.0 H1.3]
U13  ADS7886SBDCKT  [SOT23-6 P0.95 C1.5x3.0 H1.3]
U14  ADS7886SBDCKT  [SOT23-6 P0.95 C1.5x3.0 H1.3]
U15  ADS7886SBDCKT  [SOT23-6 P0.95 C1.5x3.0 H1.3]
U16  ADS7886SBDCKT  [SOT23-6 P0.95 C1.5x3.0 H1.3]
U17  ADS7886SBDCKT  [SOT23-6 P0.95 C1.5x3.0 H1.3]
U18  ADS7886SBDCKT  [SOT23-6 P0.95 C1.5x3.0 H1.3]
U19  ADS7886SBDCKT  [SOT23-6 P0.95 C1.5x3.0 H1.3]
U20  ADS7886SBDCKT  [SOT23-6 P0.95 C1.5x3.0 H1.3]
U21  ADS7886SBDCKT  [SOT23-6 P0.95 C1.5x3.0 H1.3]
U22  ADS7886SBDCKT  [SOT23-6 P0.95 C1.5x3.0 H1.3]
U23  LT1461ACS8  [SO8 P1.27 C4.0X5.0 H1.75]
U24  LM317MDTRKG  [TO252-2 P2.29 C6.2x6.7 H2.4]
U25  ADS7886SBDCKT  [SOT23-6 P0.95 C1.5x3.0 H1.3]
U26  ADS7886SBDCKT  [SOT23-6 P0.95 C1.5x3.0 H1.3]
U27  ADS7886SBDCKT  [SOT23-6 P0.95 C1.5x3.0 H1.3]

### Ports
ADC_CH1 (in), ADC_CH1_CS (in), ADC_CH1_SDO (out), ADC_CH2 (in), ADC_CH2_CS (in), ADC_CH2_SDO (out), ADC_CH3 (in), ADC_CH3_CS (in), ADC_CH3_SDO (out), ADC_CH4 (in), ADC_CH4_CS (in), ADC_CH4_SDO (out), ADC_CH5 (in), ADC_CH5_CS (in), ADC_CH5_SDO (out), ADC_CH6 (in), ADC_CH6_CS (in), ADC_CH6_SDO (out), ADC_CH7 (in), ADC_CH7_CS (in), ADC_CH7_SDO (out), ADC_CH8 (in), ADC_CH8_CS (in), ADC_CH8_SDO (out), ADC_CH9 (in), ADC_CH9_CS (in), ADC_CH9_SDO (out), ADC_CH10 (in), ADC_CH10_CS (in), ADC_CH10_SDO (out), ADC_CH11 (in), ADC_CH11_CS (in), ADC_CH11_SDO (out), ADC_CH12 (in), ADC_CH12_CS (in), ADC_CH12_SDO (out), ADC_CH13 (in), ADC_CH13_CS (in), ADC_CH13_SDO (out), ADC_CH14 (in), ADC_CH14_CS (in), ADC_CH14_SDO (out), ADC_CH15 (in), ADC_CH15_CS (in), ADC_CH15_SDO (out), ADC_CH16 (in), ADC_CH16_CS (in), ADC_CH16_SDO (out), ADC_CH17 (in), ADC_CH17_CS (in), ADC_CH17_SDO (out), ADC_CH18 (in), ADC_CH18_CS (in), ADC_CH18_SDO (out), ADC_CH19 (in), ADC_CH19_CS (in), ADC_CH19_SDO (out), ADC_CH20 (in), ADC_CH20_CS (in), ADC_CH20_SDO (out), ADC_SCLK (out)

### Nets
3VREFF: C68.2 C69.2 U6.1(VDD) U7.1(VDD) U8.1(VDD) U9.1(VDD) U10.1(VDD) U11.1(VDD) U12.1(VDD) U13.1(VDD) U14.1(VDD) U15.1(VDD) U16.1(VDD) U17.1(VDD) U18.1(VDD) U19.1(VDD) U20.1(VDD) U21.1(VDD) U22.1(VDD) U23.6(VOUT) U25.1(VDD) U26.1(VDD) U27.1(VDD)
+20V_A: C66.2 C67.2 C70.2 R121.2 U23.2(VIN) U23.3(~{SHDN}) U24.3(OUT)
+24V_BP: C71.2 U24.2(IN)
GND_A: C66.1 C67.1 C68.1 C69.1 C70.1 C71.1 C72.2 C73.2 C74.2 C75.2 R122.1 U6.2(GND) U7.2(GND) U8.2(GND) U9.2(GND) U10.2(GND) U11.2(GND) U12.2(GND) U13.2(GND) U14.2(GND) U15.2(GND) U16.2(GND) U17.2(GND) U18.2(GND) U19.2(GND) U20.2(GND) U21.2(GND) U22.2(GND) U23.4(GND) U25.2(GND) U26.2(GND) U27.2(GND)
NetC3_2: U12.3(VIN) ; port ADC_CH3
NetC4_2: U6.3(VIN) ; port ADC_CH1
NetC9_2: U15.3(VIN) ; port ADC_CH4
NetC10_2: U9.3(VIN) ; port ADC_CH2
NetC16_2: U25.3(VIN) ; port ADC_CH7
NetC17_2: U18.3(VIN) ; port ADC_CH5
NetC22_2: U26.3(VIN) ; port ADC_CH8
NetC23_2: U21.3(VIN) ; port ADC_CH6
NetC29_2: U10.3(VIN) ; port ADC_CH11
NetC30_2: U27.3(VIN) ; port ADC_CH9
NetC35_2: U13.3(VIN) ; port ADC_CH12
NetC36_2: U7.3(VIN) ; port ADC_CH10
NetC42_2: U22.3(VIN) ; port ADC_CH15
NetC43_2: U16.3(VIN) ; port ADC_CH13
NetC48_2: U8.3(VIN) ; port ADC_CH16
NetC49_2: U19.3(VIN) ; port ADC_CH14
NetC55_2: U17.3(VIN) ; port ADC_CH19
NetC56_2: U11.3(VIN) ; port ADC_CH17
NetC61_2: U20.3(VIN) ; port ADC_CH20
NetC62_2: U14.3(VIN) ; port ADC_CH18
NetC72_1: C72.1 C73.1 C74.1 C75.1
NetR121_1: R121.1 R122.2 U24.1(GND)
NetU6_4: U6.4(SCLK) U7.4(SCLK) U8.4(SCLK) U9.4(SCLK) U10.4(SCLK) U11.4(SCLK) U12.4(SCLK) U13.4(SCLK) U14.4(SCLK) U15.4(SCLK) U16.4(SCLK) U17.4(SCLK) U18.4(SCLK) U19.4(SCLK) U20.4(SCLK) U21.4(SCLK) U22.4(SCLK) U25.4(SCLK) U26.4(SCLK) U27.4(SCLK) ; port ADC_SCLK
NetU6_5: U6.5(SDO) ; port ADC_CH1_SDO
NetU6_6: U6.6(~{CS}) ; port ADC_CH1_CS
NetU7_5: U7.5(SDO) ; port ADC_CH10_SDO
NetU7_6: U7.6(~{CS}) ; port ADC_CH10_CS
NetU8_5: U8.5(SDO) ; port ADC_CH16_SDO
NetU8_6: U8.6(~{CS}) ; port ADC_CH16_CS
NetU9_5: U9.5(SDO) ; port ADC_CH2_SDO
NetU9_6: U9.6(~{CS}) ; port ADC_CH2_CS
NetU10_5: U10.5(SDO) ; port ADC_CH11_SDO
NetU10_6: U10.6(~{CS}) ; port ADC_CH11_CS
NetU11_5: U11.5(SDO) ; port ADC_CH17_SDO
NetU11_6: U11.6(~{CS}) ; port ADC_CH17_CS
NetU12_5: U12.5(SDO) ; port ADC_CH3_SDO
NetU12_6: U12.6(~{CS}) ; port ADC_CH3_CS
NetU13_5: U13.5(SDO) ; port ADC_CH12_SDO
NetU13_6: U13.6(~{CS}) ; port ADC_CH12_CS
NetU14_5: U14.5(SDO) ; port ADC_CH18_SDO
NetU14_6: U14.6(~{CS}) ; port ADC_CH18_CS
NetU15_5: U15.5(SDO) ; port ADC_CH4_SDO
NetU15_6: U15.6(~{CS}) ; port ADC_CH4_CS
NetU16_5: U16.5(SDO) ; port ADC_CH13_SDO
NetU16_6: U16.6(~{CS}) ; port ADC_CH13_CS
NetU17_5: U17.5(SDO) ; port ADC_CH19_SDO
NetU17_6: U17.6(~{CS}) ; port ADC_CH19_CS
NetU18_5: U18.5(SDO) ; port ADC_CH5_SDO
NetU18_6: U18.6(~{CS}) ; port ADC_CH5_CS
NetU19_5: U19.5(SDO) ; port ADC_CH14_SDO
NetU19_6: U19.6(~{CS}) ; port ADC_CH14_CS
NetU20_5: U20.5(SDO) ; port ADC_CH20_SDO
NetU20_6: U20.6(~{CS}) ; port ADC_CH20_CS
NetU21_5: U21.5(SDO) ; port ADC_CH6_SDO
NetU21_6: U21.6(~{CS}) ; port ADC_CH6_CS
NetU22_5: U22.5(SDO) ; port ADC_CH15_SDO
NetU22_6: U22.6(~{CS}) ; port ADC_CH15_CS
NetU25_5: U25.5(SDO) ; port ADC_CH7_SDO
NetU25_6: U25.6(~{CS}) ; port ADC_CH7_CS
NetU26_5: U26.5(SDO) ; port ADC_CH8_SDO
NetU26_6: U26.6(~{CS}) ; port ADC_CH8_CS
NetU27_5: U27.5(SDO) ; port ADC_CH9_SDO
NetU27_6: U27.6(~{CS}) ; port ADC_CH9_CS

### Notes on the sheet
- 100nF - 10uF per ADC
- Date :
- Revision :
- Sheet
- of
- Design by :

### Library data of the parts
C66-C75 = Capacitor
  C66-C69 C73 C75: Value: 10uF
  C70: Value: 1uF
  C71: Value: 0.1uF
  C72 C74: Value: 100nF
R121 R122 = Resistor: Resistor 1% 50V 100mW 1608(0603)
  R121: Value: 1k
  R122: Value: 15k
U6-U22 U25-U27 = ADS7886SBDCKT: 12-Bit, 1-MSPS, Micro-Power, Miniature SAR Analog-to-Digital Converters; Value: ADS7886SBDCKT
U23 = LT1461ACS8: Micropower Precision Low Dropout Series Voltage Reference Family; Value: LT1461ACS8
U24 = REGPOS TO252-2 GND,VIN,OUT: Generic Positive Voltage Regulator; Value: LM317MDTRKG

## Sheet FPGA-7.SchDoc
size A3; Date: Date; CompanyName: HESSO; Engineer: Name; Address1: Route du Rawyl 47; Address2: 1950 Sion; Address3: Switzerland; ProjectName: Project Name
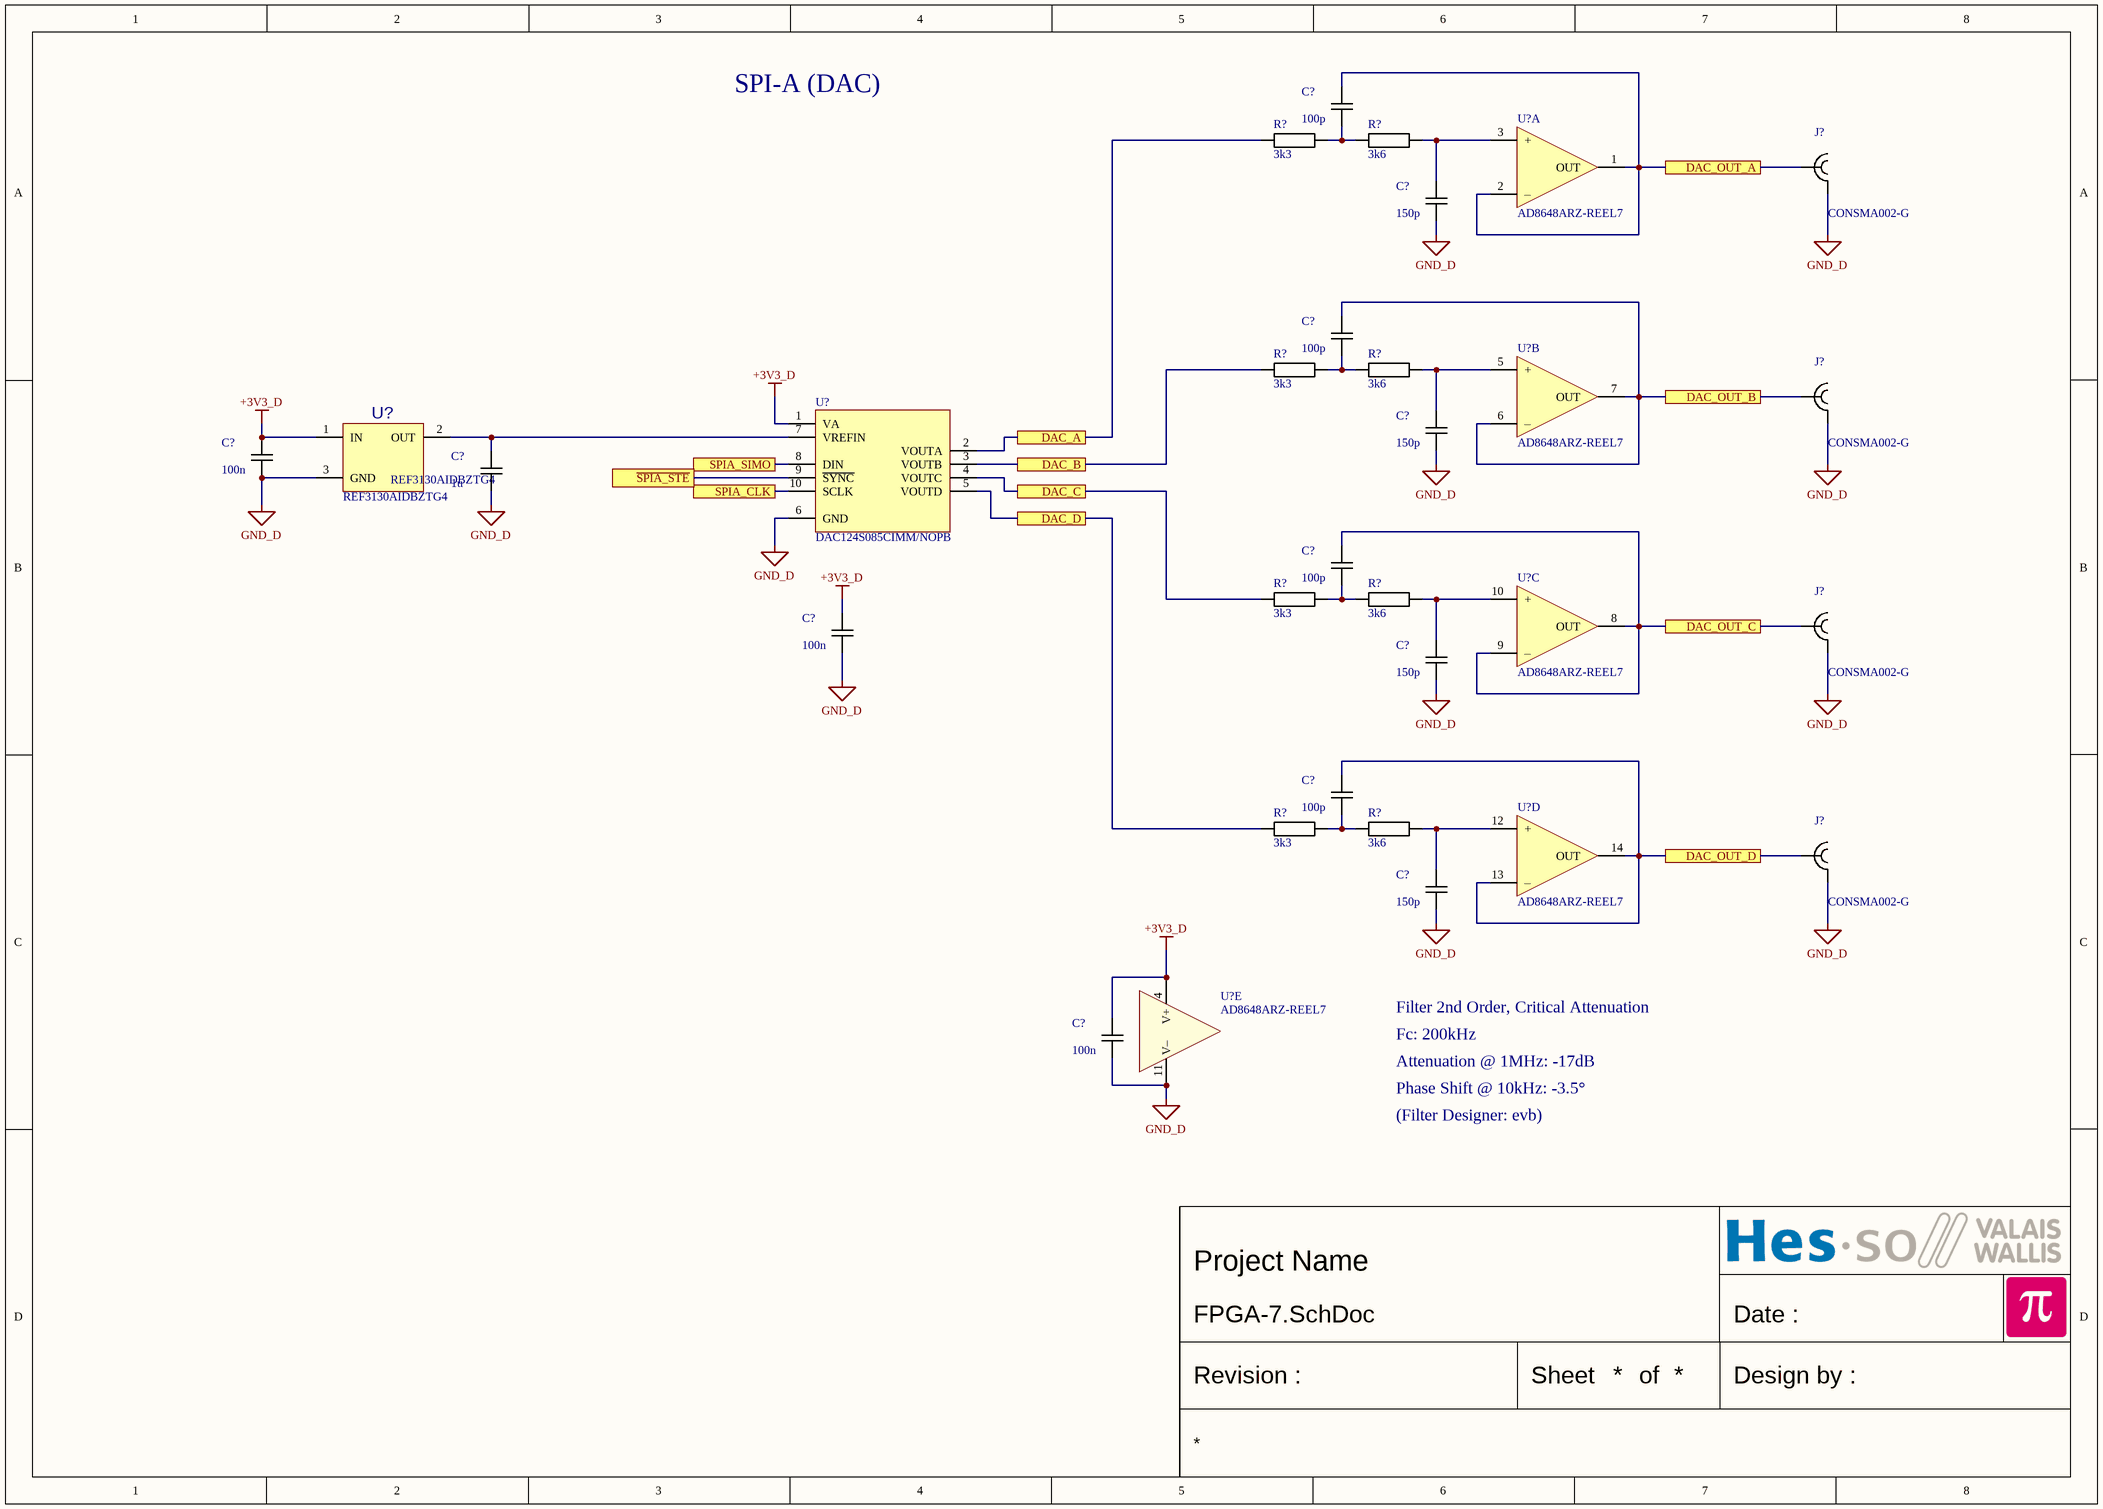
[diagram p9: FPGA-7.SchDoc]

### Parts
(Parts that share a designator on the sheet are numbered #1, #2 ... from top to bottom, then left to right.)
C?#13  100p  [CAPACITOR 2012 REFLOW]
C?#14  150p  [CAPACITOR 2012 REFLOW]
C?#15  100p  [CAPACITOR 2012 REFLOW]
C?#16  150p  [CAPACITOR 2012 REFLOW]
C?#17  100n  [CAPACITOR 2012 REFLOW]
C?#18  1u  [CAPACITOR 2012 REFLOW]
C?#19  100p  [CAPACITOR 2012 REFLOW]
C?#20  100n  [CAPACITOR 1608 REFLOW]
C?#21  150p  [CAPACITOR 2012 REFLOW]
C?#22  100p  [CAPACITOR 2012 REFLOW]
C?#23  150p  [CAPACITOR 2012 REFLOW]
C?#24  100n  [CAPACITOR 1608 REFLOW]
J?#5  CONSMA002-G  [SMA TH Right Angle Linx CONSMA002]
J?#6  CONSMA002-G  [SMA TH Right Angle Linx CONSMA002]
J?#7  CONSMA002-G  [SMA TH Right Angle Linx CONSMA002]
J?#8  CONSMA002-G  [SMA TH Right Angle Linx CONSMA002]
R?#9  3k3  [RESISTOR 2012 REFLOW]
R?#10  3k6  [RESISTOR 2012 REFLOW]
R?#11  3k3  [RESISTOR 2012 REFLOW]
R?#12  3k6  [RESISTOR 2012 REFLOW]
R?#13  3k3  [RESISTOR 2012 REFLOW]
R?#14  3k6  [RESISTOR 2012 REFLOW]
R?#15  3k3  [RESISTOR 2012 REFLOW]
R?#16  3k6  [RESISTOR 2012 REFLOW]
U?#8  AD8648ARZ-REEL7  [SO14 P1.27 C4.0X8.8 H1.75]  (part A of 5)
U?#9  DAC124S085CIMM/NOPB  [VSSOP10 P0.5 C3.1X3.1 H1.1]
U?#10  AD8648ARZ-REEL7  [SO14 P1.27 C4.0X8.8 H1.75]  (part B of 5)
U?#11  REF3130AIDBZTG4  [SOT23 P0.95 C1.6x3.0 H1.3]
U?#12  AD8648ARZ-REEL7  [SO14 P1.27 C4.0X8.8 H1.75]  (part C of 5)
U?#13  AD8648ARZ-REEL7  [SO14 P1.27 C4.0X8.8 H1.75]  (part D of 5)
U?#14  AD8648ARZ-REEL7  [SO14 P1.27 C4.0X8.8 H1.75]  (part E of 5)

### Ports
DAC_A, DAC_B, DAC_C, DAC_D, DAC_OUT_A, DAC_OUT_B, DAC_OUT_C, DAC_OUT_D, SPIA_CLK, SPIA_SIMO, ~{SPIA_STE}

### Nets
+3V3_D: C?#17.2 C?#20.2 C?#24.2 U?#9.1(VA) U?#11.1(IN) U?#14.4(V+)
GND_D: C?#14.1 C?#16.1 C?#17.1 C?#18.1 C?#20.1 C?#21.1 C?#23.1 C?#24.1 J?#5.2 J?#6.2 J?#7.2 J?#8.2 U?#9.6(GND) U?#11.3(GND) U?#14.11(V–)
NetC?#1_2: C?#13.2 J?#5.1 U?#8.1(OUT) U?#8.2(–) ; port DAC_OUT_A
NetC?#3_2: C?#15.2 J?#6.1 U?#10.6(–) U?#10.7(OUT) ; port DAC_OUT_B
NetC?#7_2: C?#19.2 J?#7.1 U?#12.8(OUT) U?#12.9(–) ; port DAC_OUT_C
NetC?#10_2: C?#22.2 J?#8.1 U?#13.13(–) U?#13.14(OUT) ; port DAC_OUT_D
NetC?#13_1: C?#13.1 R?#9.2 R?#10.1
NetC?#14_2: C?#14.2 R?#10.2 U?#8.3(+)
NetC?#15_1: C?#15.1 R?#11.2 R?#12.1
NetC?#16_2: C?#16.2 R?#12.2 U?#10.5(+)
NetC?#18_2: C?#18.2 U?#9.7(VREFIN) U?#11.2(OUT)
NetC?#19_1: C?#19.1 R?#13.2 R?#14.1
NetC?#21_2: C?#21.2 R?#14.2 U?#12.10(+)
NetC?#22_1: C?#22.1 R?#15.2 R?#16.1
NetC?#23_2: C?#23.2 R?#16.2 U?#13.12(+)
NetR?#1_1: R?#9.1 U?#9.2(VOUTA) ; port DAC_A
NetR?#3_1: R?#11.1 U?#9.3(VOUTB) ; port DAC_B
NetR?#5_1: R?#13.1 U?#9.4(VOUTC) ; port DAC_C
NetR?#7_1: R?#15.1 U?#9.5(VOUTD) ; port DAC_D
NetU?#2_8: U?#9.8(DIN) ; port SPIA_SIMO
NetU?#2_9: U?#9.9(~{SYNC}) ; port ~{SPIA_STE}
NetU?#2_10: U?#9.10(SCLK) ; port SPIA_CLK

### Notes on the sheet
- SPI-A (DAC)
- Filter 2nd Order, Critical Attenuation
- Fc: 200kHz
- Attenuation @ 1MHz: -17dB
- Phase Shift @ 10kHz: -3.5°
- (Filter Designer: evb)
- Date :
- Revision :
- Sheet
- of
- Design by :

### Library data of the parts
C?#13-C?#17 C?#19 C?#21-C?#23 = Capacitor: Capacitor X7R 10% 50V 2012(0805)
  C?#13 C?#15 C?#19 C?#22: Value: 100p
  C?#14 C?#16 C?#21 C?#23: Value: 150p
  C?#17: Value: 100n
C?#18 = Capacitor: Capacitor X7R 10% 10V 2012(0805); Value: 1u
C?#20 C?#24 = Capacitor: Capacitor X7R 10% 50V 1608(0603); Value: 100n
J?#5-J?#8 = SMA TH RIGHT ANGLE LINX CONSMA002: Manufacturer: Linx Technologies; Value: CONSMA002-G; Mouser No.: 712-CONSMA002-G
R?#9-R?#16 = Resistor: Resistor 1% 50V 125mW 2012(0805)
  R?#9 R?#11 R?#13 R?#15: Value: 3k3
  R?#10 R?#12 R?#14 R?#16: Value: 3k6
U?#8 U?#10 U?#12-U?#14 = OPA QUAD: as U?#1 on sheet FPGA-8; Value: AD8648ARZ-REEL7; Mouser No.: 584-AD8648ARZ-R7
U?#9 = DAC124S085CIMM: as U?#2 on sheet FPGA-8; Value: DAC124S085CIMM/NOPB; Mouser No.: 926-DAC124S085CIMMNO
U?#11 = REFERENCE SOT23 IN-OUT- GND: as U?#4 on sheet FPGA-8; Value: REF3130AIDBZTG4; Mouser No.: 595-REF3130AIDBZTG4